# EAGLE schematic OpenBCI_Board (EAGLE 9.7.0)
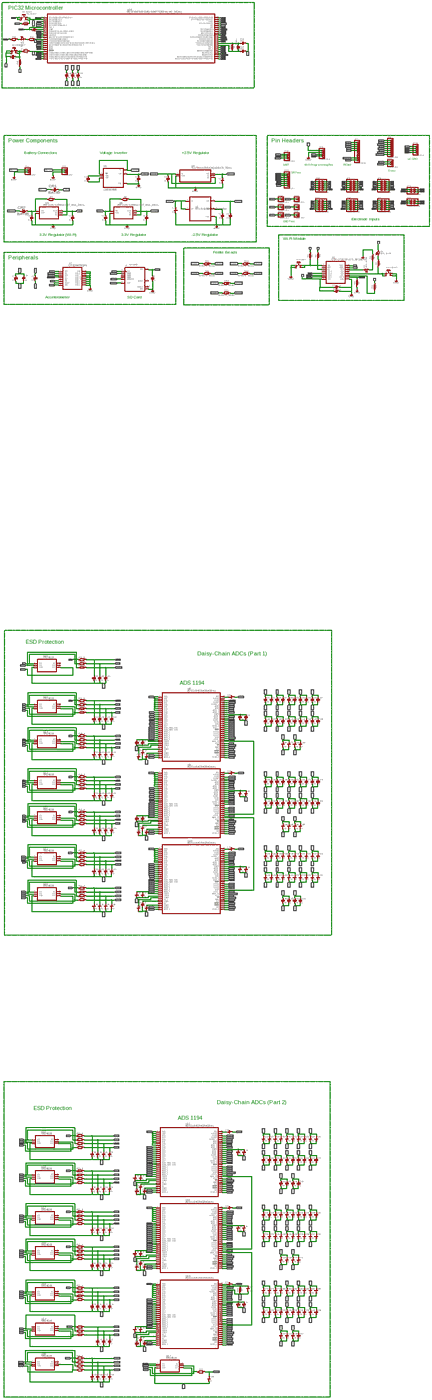
[diagram p0: schematic, sheet 1, overview]
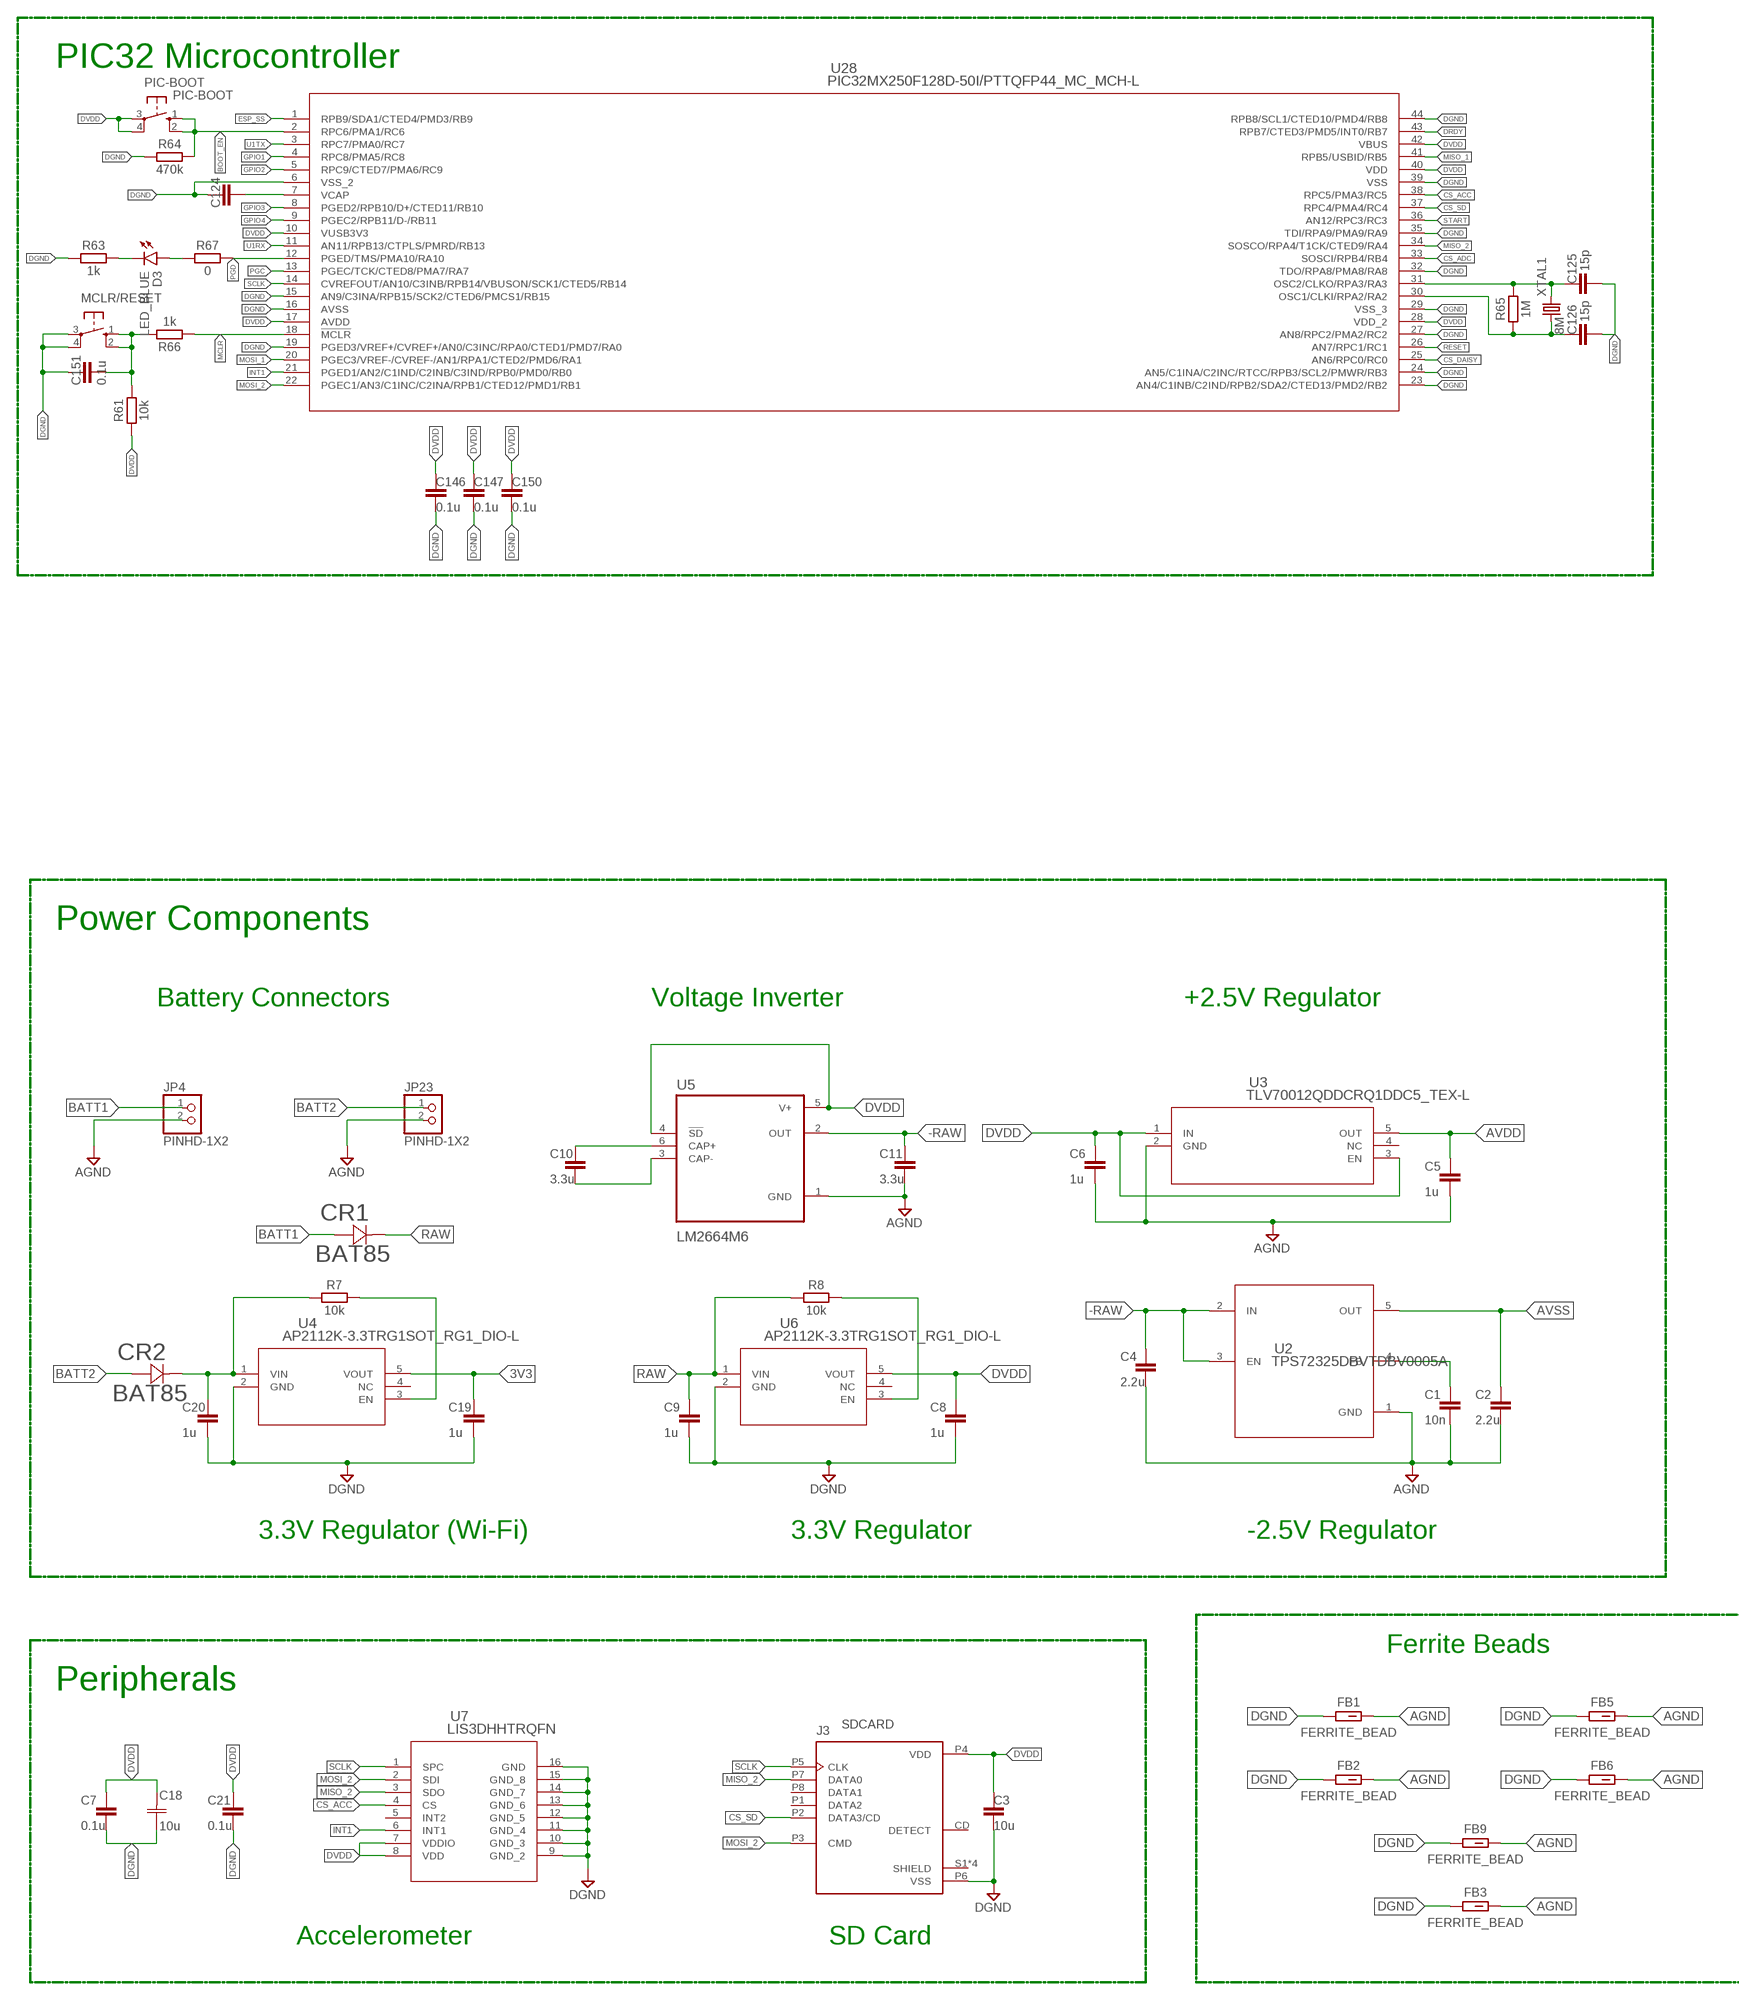
[diagram p1: schematic, sheet 1, part 1 of 4]
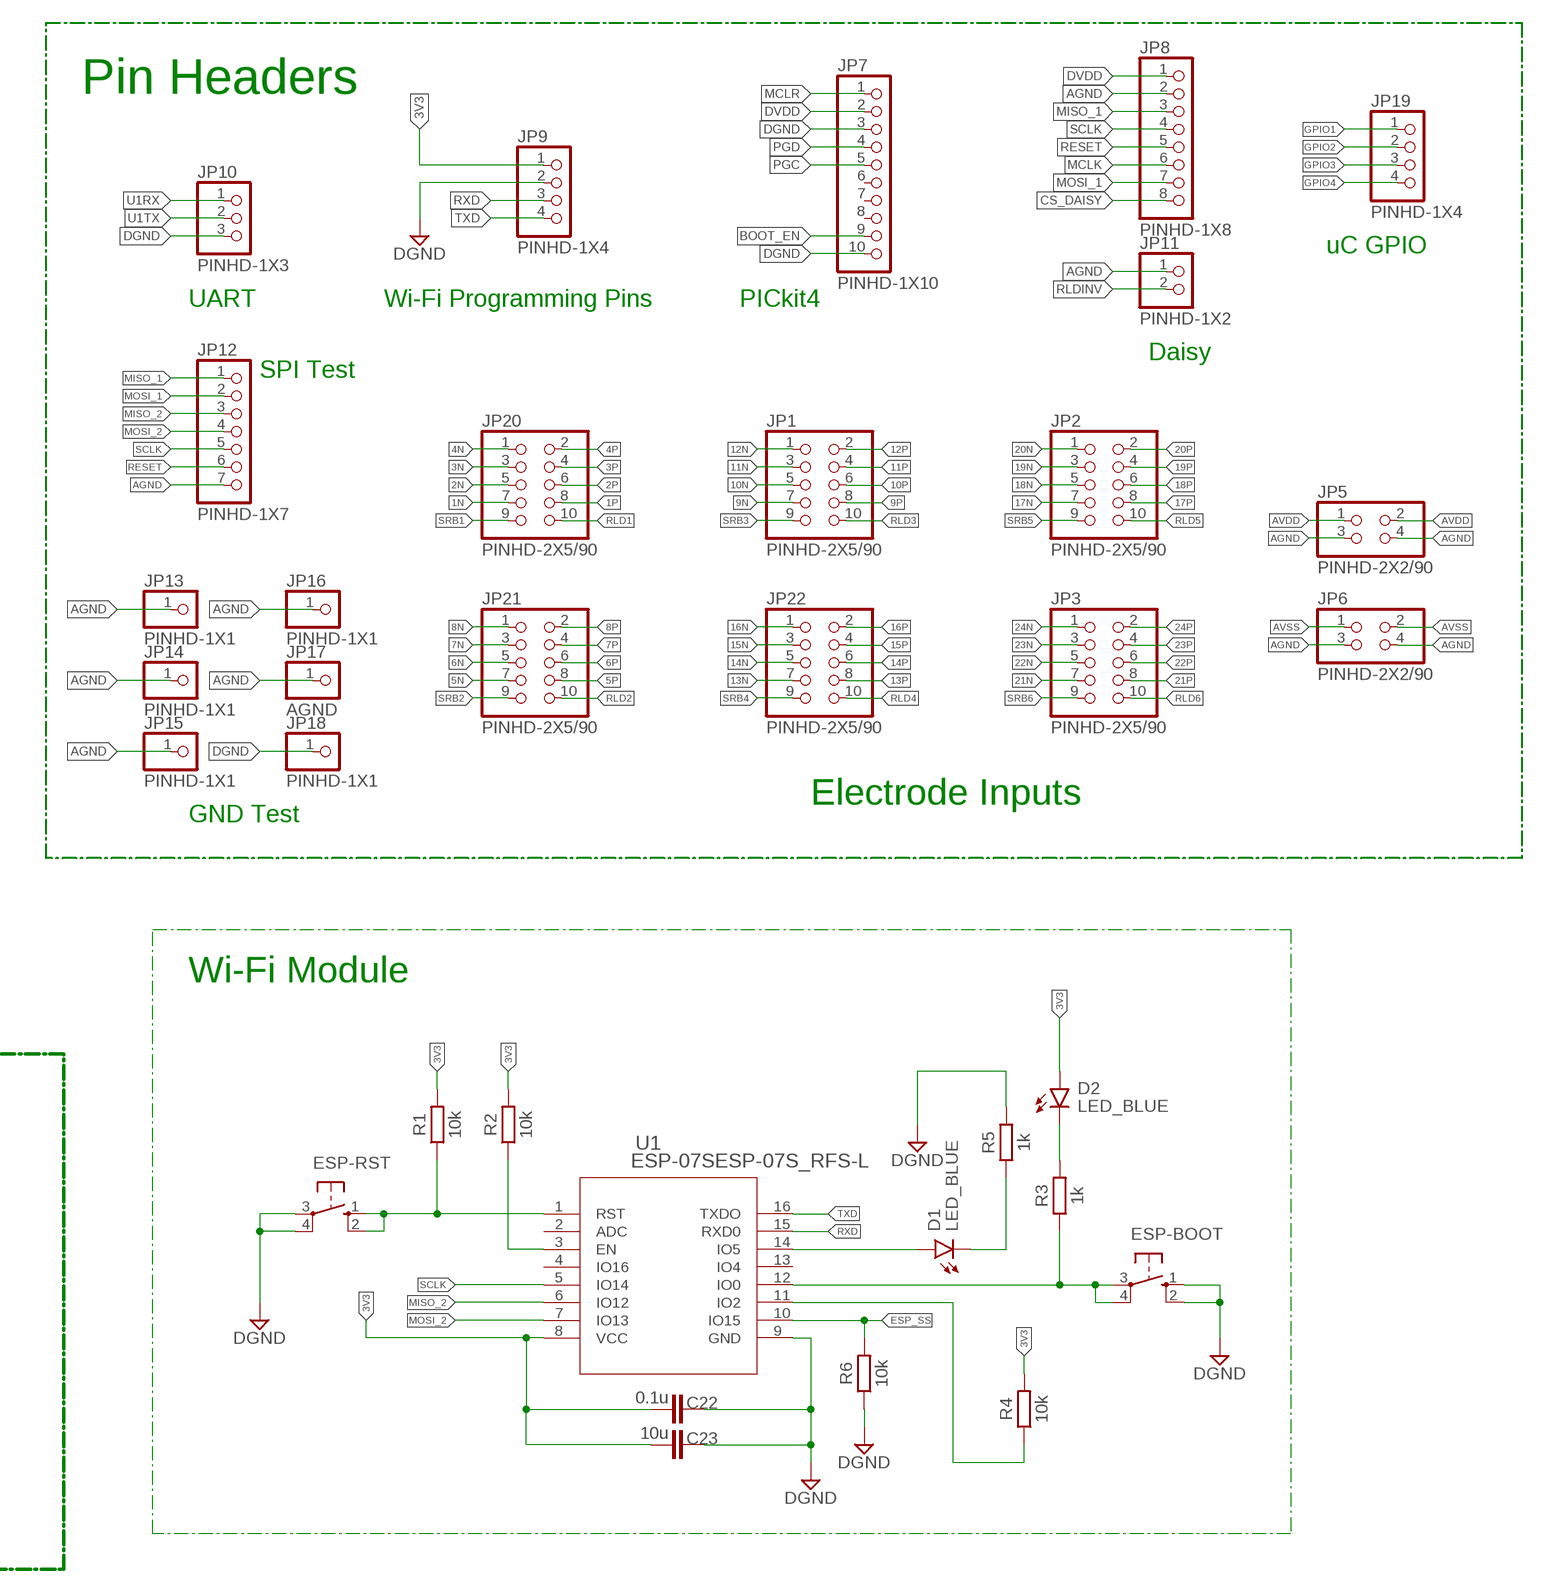
[diagram p2: schematic, sheet 1, part 2 of 4]
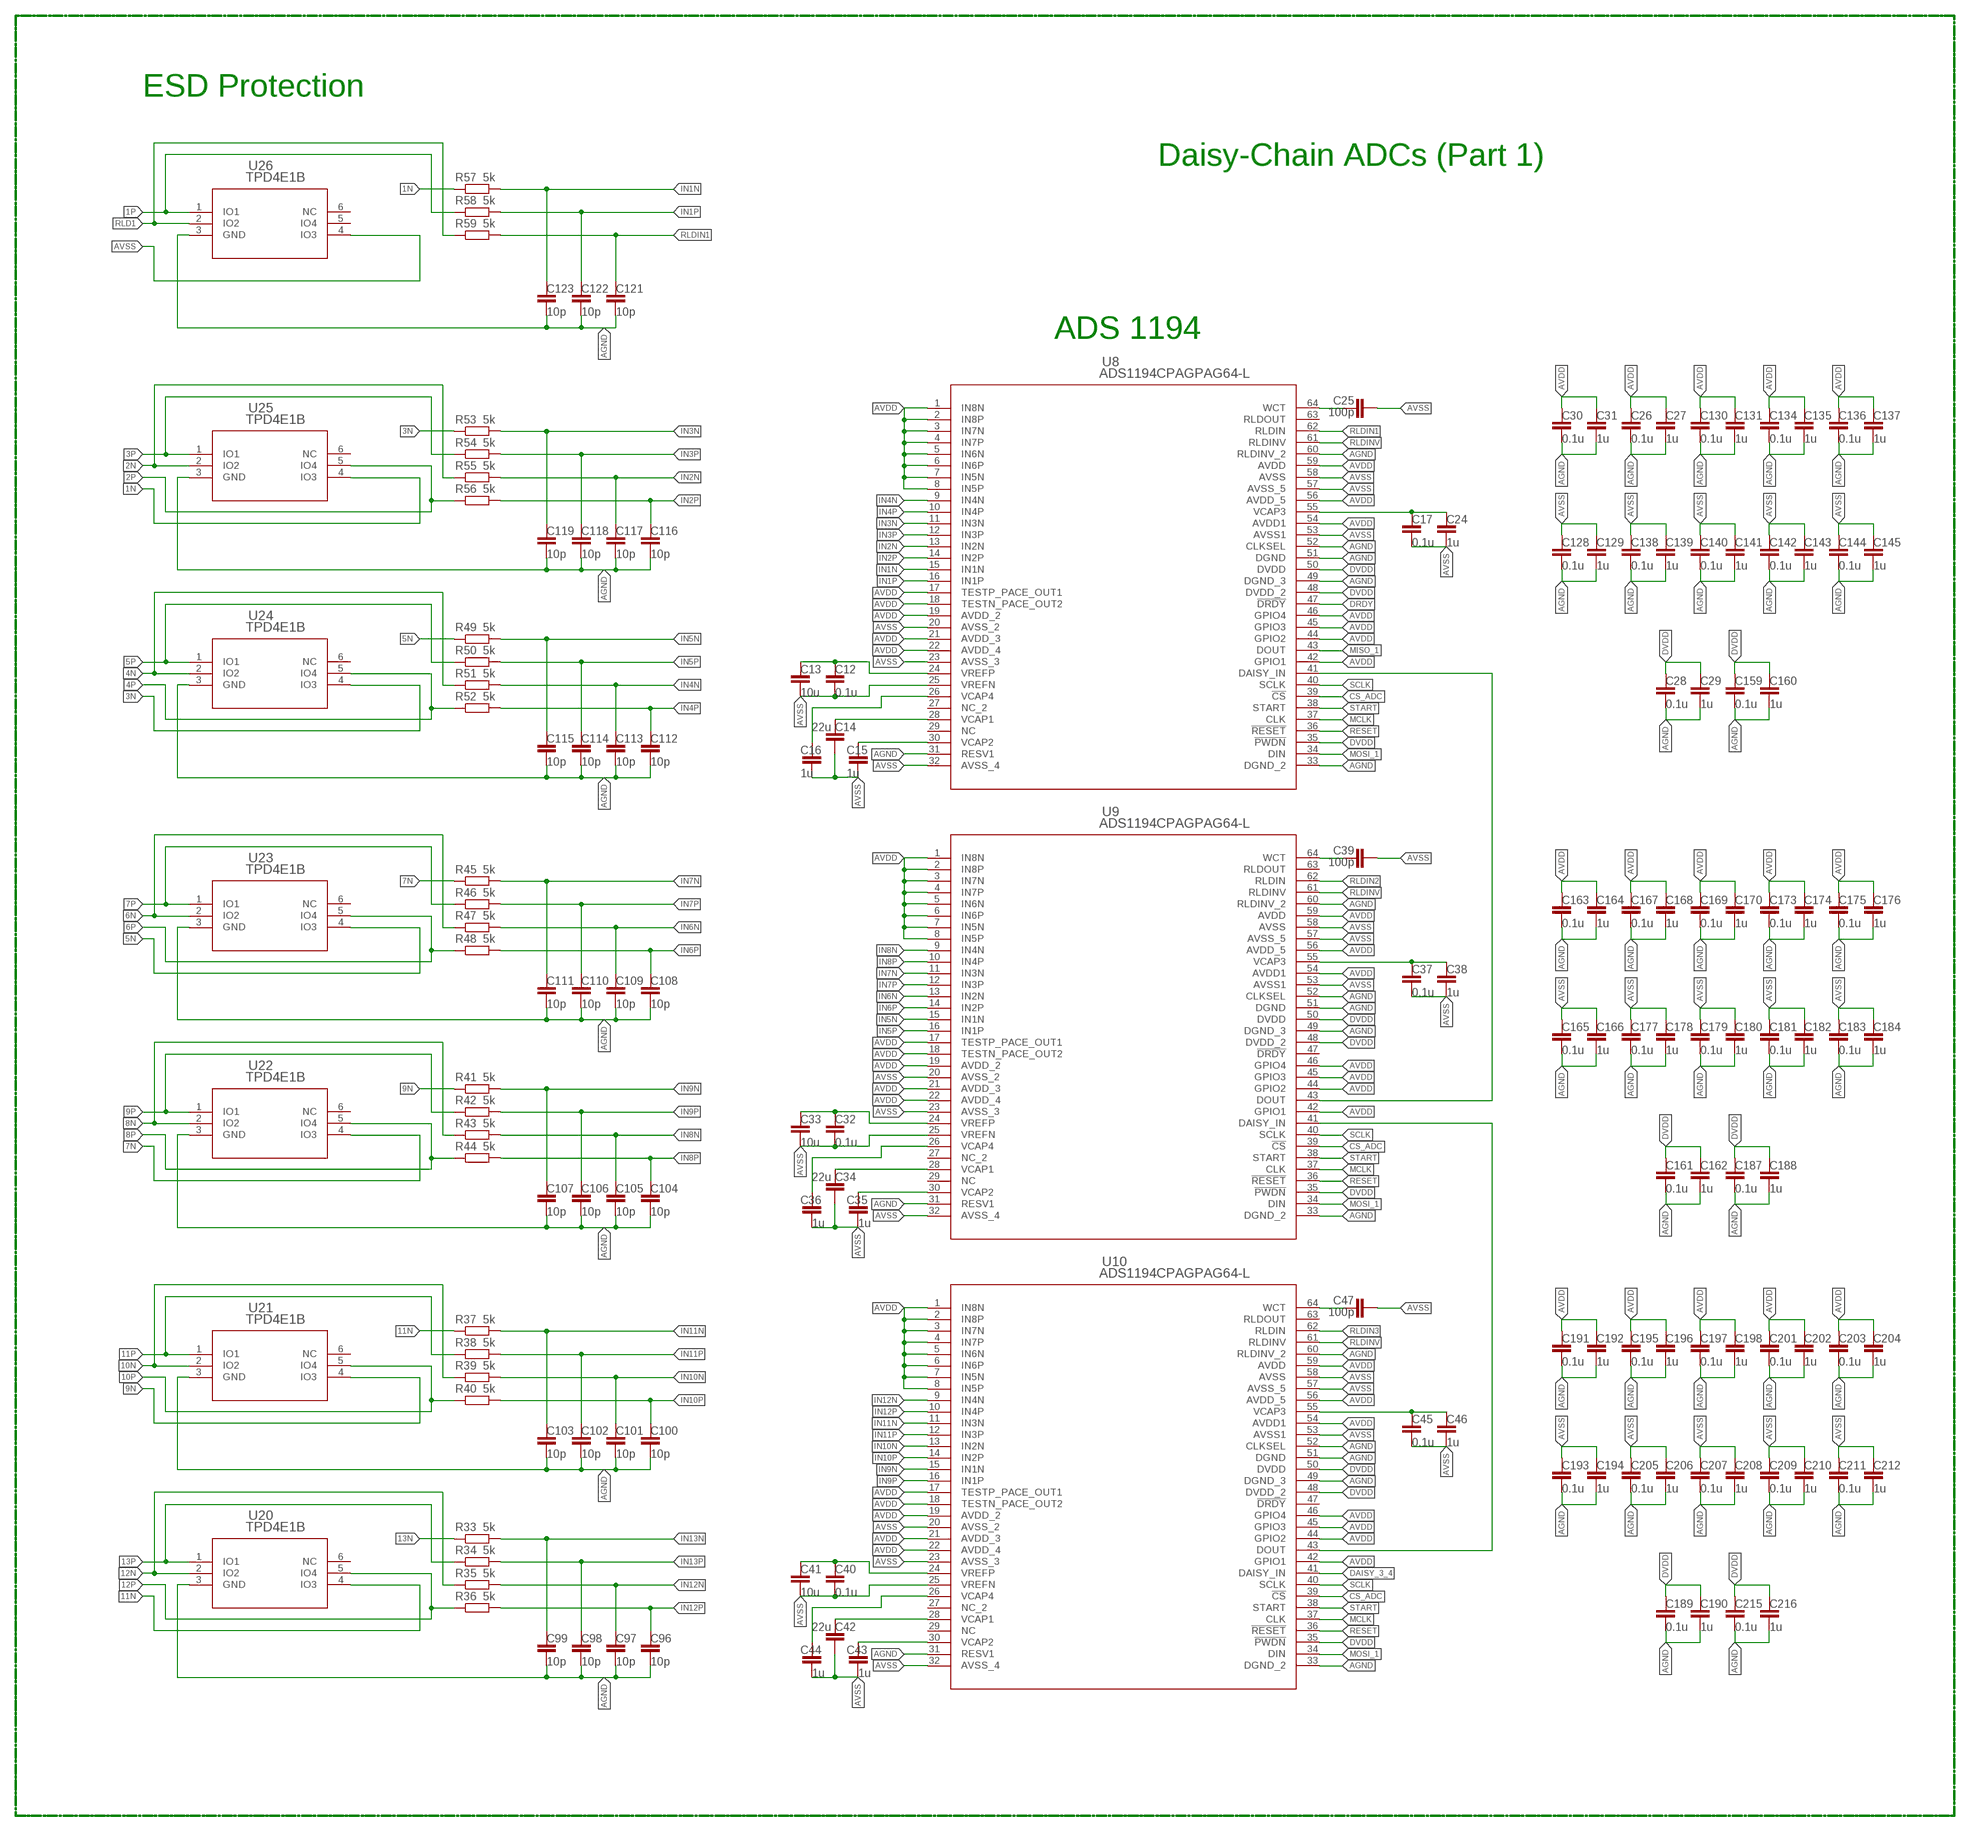
[diagram p3: schematic, sheet 1, part 3 of 4]
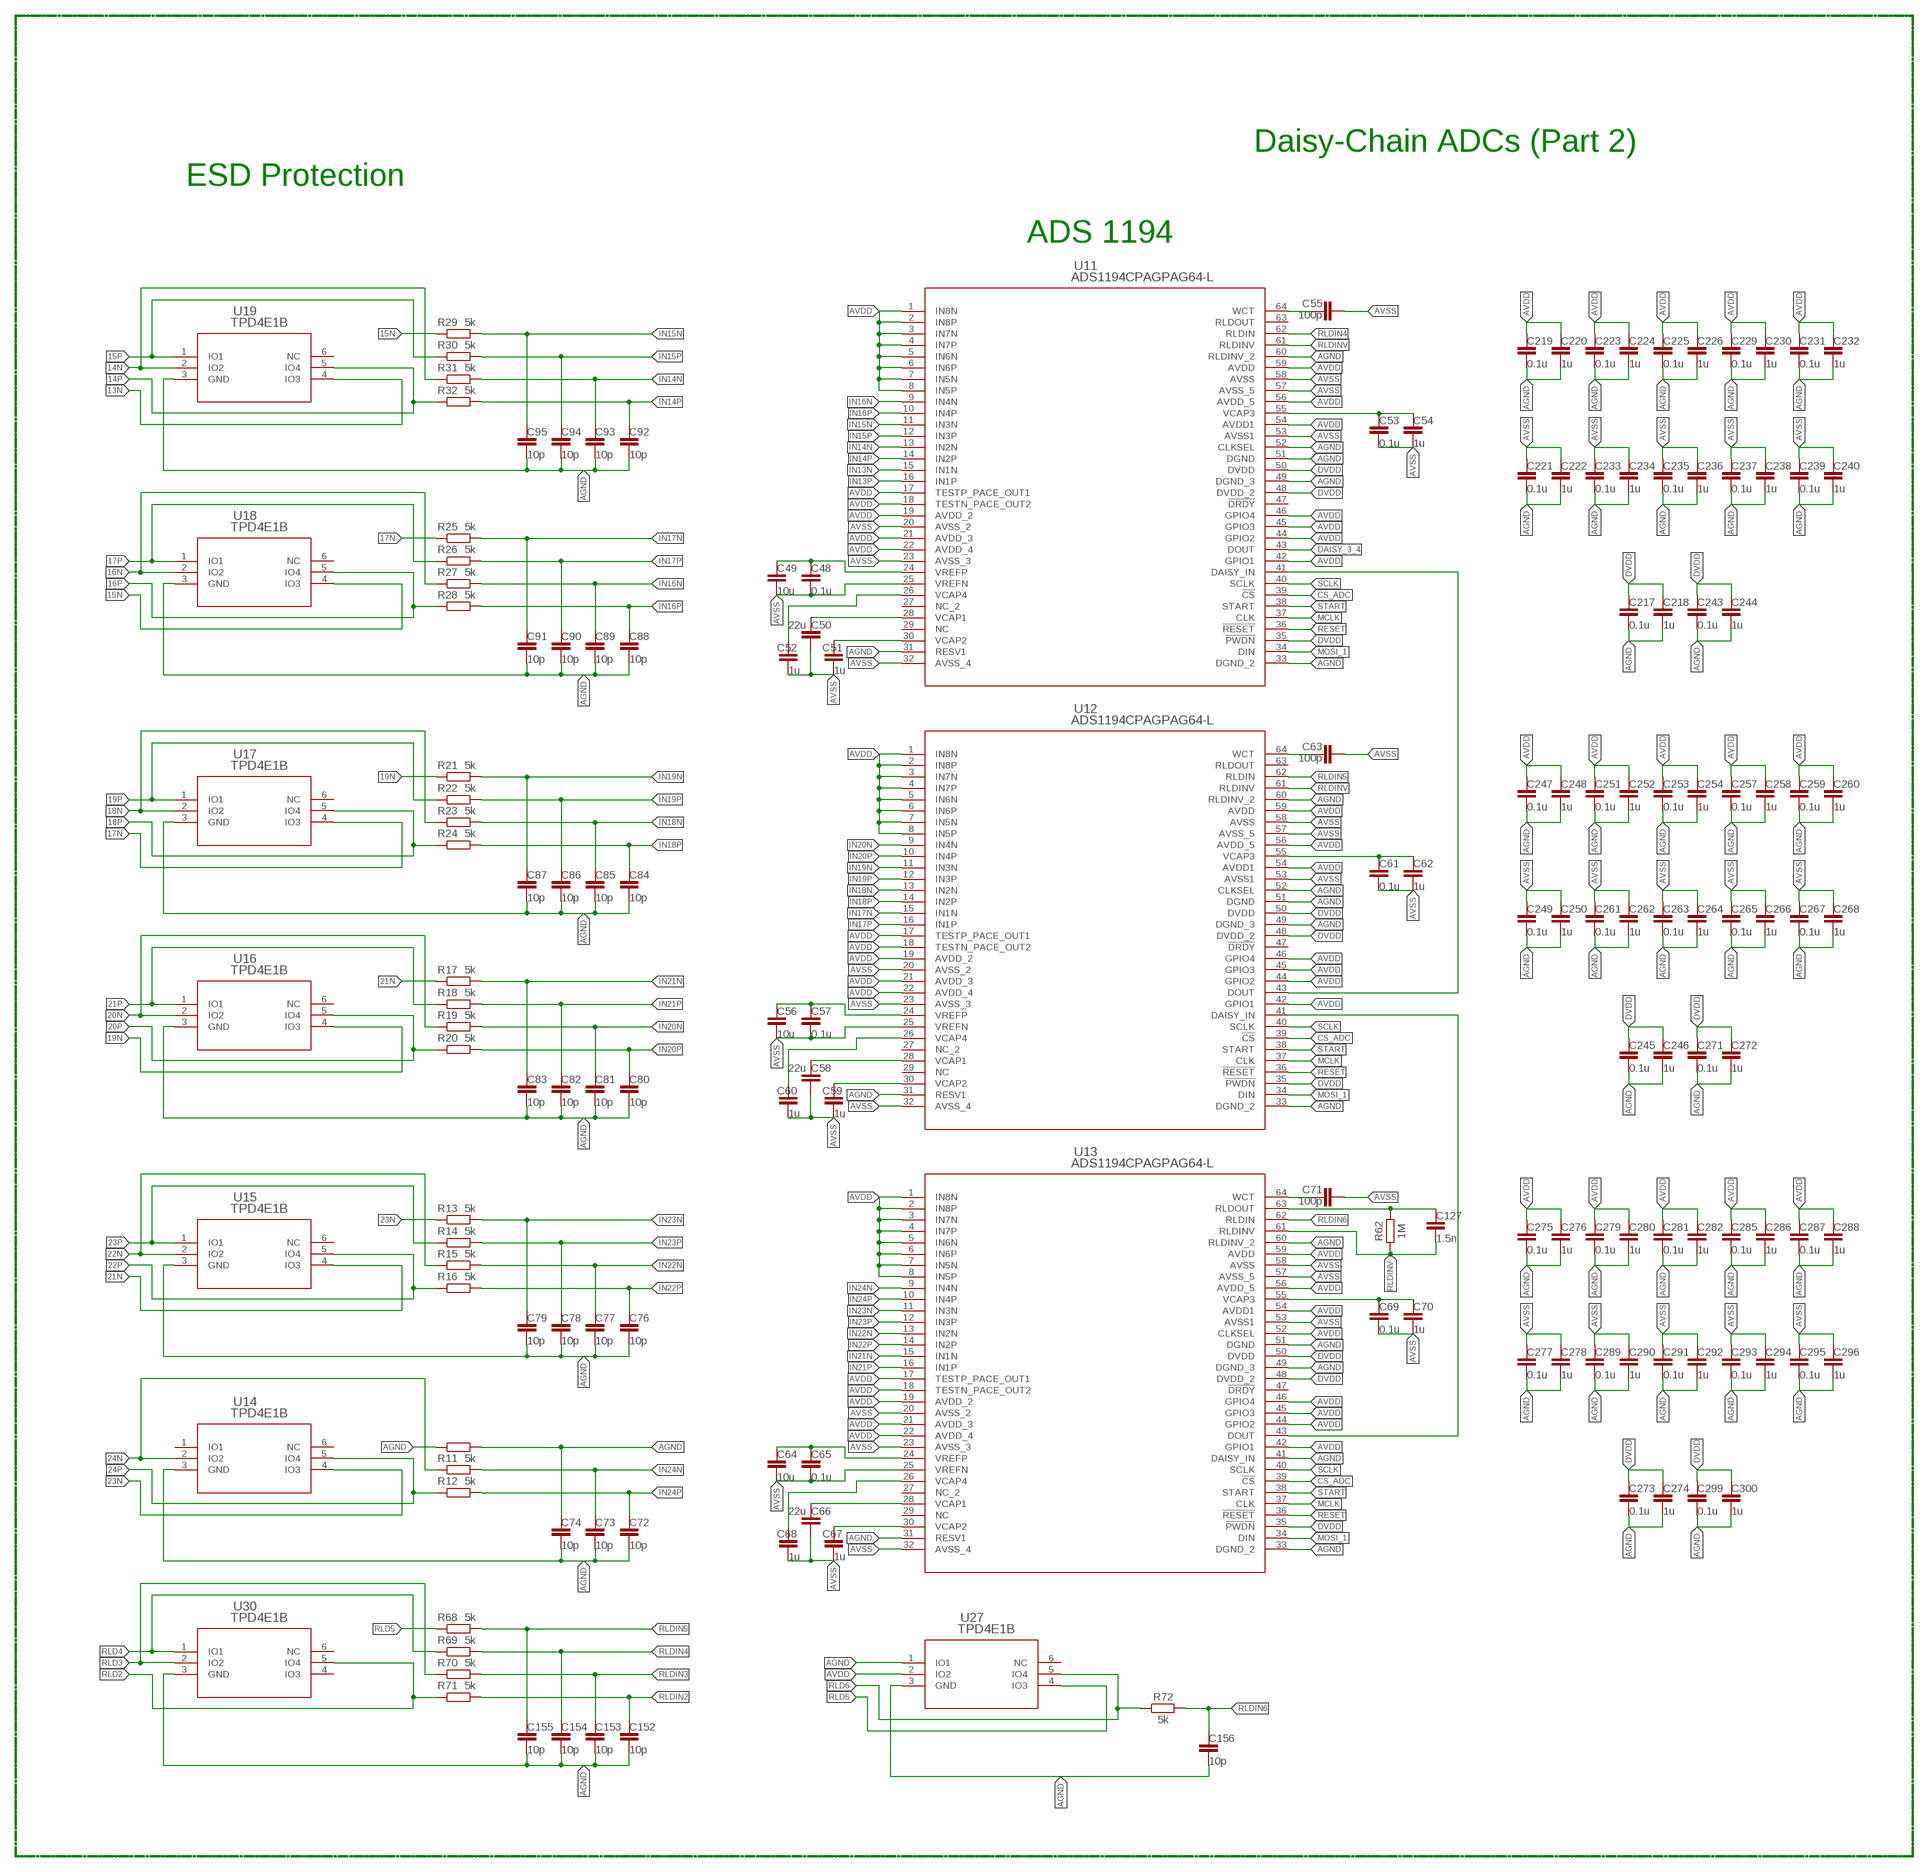
[diagram p4: schematic, sheet 1, part 4 of 4]

## Parts
C1  10n  C_CHIP-0603(1608-METRIC)  [CAPC1608X85]
C2  2.2u  C_CHIP-0603(1608-METRIC)  [CAPC1608X85]
C3  10u  C_CHIP-1206(3216-METRIC)  [CAPC3216X135]
C4  2.2u  C_CHIP-0603(1608-METRIC)  [CAPC1608X85]
C5  1u  C_CHIP-0805(2012-METRIC)  [CAPC2012X110]
C6  1u  C_CHIP-0805(2012-METRIC)  [CAPC2012X110]
C7  0.1u  C_CHIP-0805(2012-METRIC)  [CAPC2012X110]
C8  1u  C_CHIP-0805(2012-METRIC)  [CAPC2012X110]
C9  1u  C_CHIP-0805(2012-METRIC)  [CAPC2012X110]
C10  3.3u  C_CHIP-0603(1608-METRIC)  [CAPC1608X85]
C11  3.3u  C_CHIP-0603(1608-METRIC)  [CAPC1608X85]
C12  0.1u  C_CHIP-0805(2012-METRIC)  [CAPC2012X110]
C13  10u  C_CHIP-1206(3216-METRIC)  [CAPC3216X135]
C14  22u  C_CHIP-1206(3216-METRIC)  [CAPC3216X135]
C15  1u  C_CHIP-0805(2012-METRIC)  [CAPC2012X110]
C16  1u  C_CHIP-0805(2012-METRIC)  [CAPC2012X110]
C17  0.1u  C_CHIP-0805(2012-METRIC)  [CAPC2012X110]
C18  10u  MCVVT035M470EA1LCAP_MCVV_A1_MTC-L  [CAP_MCVV_A1_MTC-L]
C19  1u  C_CHIP-0805(2012-METRIC)  [CAPC2012X110]
C20  1u  C_CHIP-0805(2012-METRIC)  [CAPC2012X110]
C21  0.1u  C_CHIP-0805(2012-METRIC)  [CAPC2012X110]
C22  0.1u  C_CHIP-0805(2012-METRIC)  [CAPC2012X110]
C23  10u  C_CHIP-1206(3216-METRIC)  [CAPC3216X135]
C24  1u  C_CHIP-0805(2012-METRIC)  [CAPC2012X110]
C25  100p  C_CHIP-0603(1608-METRIC)  [CAPC1608X85]
C26  0.1u  C_CHIP-0805(2012-METRIC)  [CAPC2012X110]
C27  1u  C_CHIP-0805(2012-METRIC)  [CAPC2012X110]
C28  0.1u  C_CHIP-0805(2012-METRIC)  [CAPC2012X110]
C29  1u  C_CHIP-0805(2012-METRIC)  [CAPC2012X110]
C30  0.1u  C_CHIP-0805(2012-METRIC)  [CAPC2012X110]
C31  1u  C_CHIP-0805(2012-METRIC)  [CAPC2012X110]
C32  0.1u  C_CHIP-0805(2012-METRIC)  [CAPC2012X110]
C33  10u  C_CHIP-1206(3216-METRIC)  [CAPC3216X135]
C34  22u  C_CHIP-1206(3216-METRIC)  [CAPC3216X135]
C35  1u  C_CHIP-0805(2012-METRIC)  [CAPC2012X110]
C36  1u  C_CHIP-0805(2012-METRIC)  [CAPC2012X110]
C37  0.1u  C_CHIP-0805(2012-METRIC)  [CAPC2012X110]
C38  1u  C_CHIP-0805(2012-METRIC)  [CAPC2012X110]
C39  100p  C_CHIP-0603(1608-METRIC)  [CAPC1608X85]
C40  0.1u  C_CHIP-0805(2012-METRIC)  [CAPC2012X110]
C41  10u  C_CHIP-1206(3216-METRIC)  [CAPC3216X135]
C42  22u  C_CHIP-1206(3216-METRIC)  [CAPC3216X135]
C43  1u  C_CHIP-0805(2012-METRIC)  [CAPC2012X110]
C44  1u  C_CHIP-0805(2012-METRIC)  [CAPC2012X110]
C45  0.1u  C_CHIP-0805(2012-METRIC)  [CAPC2012X110]
C46  1u  C_CHIP-0805(2012-METRIC)  [CAPC2012X110]
C47  100p  C_CHIP-0603(1608-METRIC)  [CAPC1608X85]
C48  0.1u  C_CHIP-0805(2012-METRIC)  [CAPC2012X110]
C49  10u  C_CHIP-1206(3216-METRIC)  [CAPC3216X135]
C50  22u  C_CHIP-1206(3216-METRIC)  [CAPC3216X135]
C51  1u  C_CHIP-0805(2012-METRIC)  [CAPC2012X110]
C52  1u  C_CHIP-0805(2012-METRIC)  [CAPC2012X110]
C53  0.1u  C_CHIP-0805(2012-METRIC)  [CAPC2012X110]
C54  1u  C_CHIP-0805(2012-METRIC)  [CAPC2012X110]
C55  100p  C_CHIP-0603(1608-METRIC)  [CAPC1608X85]
C56  10u  C_CHIP-1206(3216-METRIC)  [CAPC3216X135]
C57  0.1u  C_CHIP-0805(2012-METRIC)  [CAPC2012X110]
C58  22u  C_CHIP-1206(3216-METRIC)  [CAPC3216X135]
C59  1u  C_CHIP-0805(2012-METRIC)  [CAPC2012X110]
C60  1u  C_CHIP-0805(2012-METRIC)  [CAPC2012X110]
C61  0.1u  C_CHIP-0805(2012-METRIC)  [CAPC2012X110]
C62  1u  C_CHIP-0805(2012-METRIC)  [CAPC2012X110]
C63  100p  C_CHIP-0603(1608-METRIC)  [CAPC1608X85]
C64  10u  C_CHIP-1206(3216-METRIC)  [CAPC3216X135]
C65  0.1u  C_CHIP-0805(2012-METRIC)  [CAPC2012X110]
C66  22u  C_CHIP-1206(3216-METRIC)  [CAPC3216X135]
C67  1u  C_CHIP-0805(2012-METRIC)  [CAPC2012X110]
C68  1u  C_CHIP-0805(2012-METRIC)  [CAPC2012X110]
C69  0.1u  C_CHIP-0805(2012-METRIC)  [CAPC2012X110]
C70  1u  C_CHIP-0805(2012-METRIC)  [CAPC2012X110]
C71  100p  C_CHIP-0603(1608-METRIC)  [CAPC1608X85]
C72  10p  C_CHIP-0603(1608-METRIC)  [CAPC1608X85]
C73  10p  C_CHIP-0603(1608-METRIC)  [CAPC1608X85]
C74  10p  C_CHIP-0603(1608-METRIC)  [CAPC1608X85]
C76  10p  C_CHIP-0603(1608-METRIC)  [CAPC1608X85]
C77  10p  C_CHIP-0603(1608-METRIC)  [CAPC1608X85]
C78  10p  C_CHIP-0603(1608-METRIC)  [CAPC1608X85]
C79  10p  C_CHIP-0603(1608-METRIC)  [CAPC1608X85]
C80  10p  C_CHIP-0603(1608-METRIC)  [CAPC1608X85]
C81  10p  C_CHIP-0603(1608-METRIC)  [CAPC1608X85]
C82  10p  C_CHIP-0603(1608-METRIC)  [CAPC1608X85]
C83  10p  C_CHIP-0603(1608-METRIC)  [CAPC1608X85]
C84  10p  C_CHIP-0603(1608-METRIC)  [CAPC1608X85]
C85  10p  C_CHIP-0603(1608-METRIC)  [CAPC1608X85]
C86  10p  C_CHIP-0603(1608-METRIC)  [CAPC1608X85]
C87  10p  C_CHIP-0603(1608-METRIC)  [CAPC1608X85]
C88  10p  C_CHIP-0603(1608-METRIC)  [CAPC1608X85]
C89  10p  C_CHIP-0603(1608-METRIC)  [CAPC1608X85]
C90  10p  C_CHIP-0603(1608-METRIC)  [CAPC1608X85]
C91  10p  C_CHIP-0603(1608-METRIC)  [CAPC1608X85]
C92  10p  C_CHIP-0603(1608-METRIC)  [CAPC1608X85]
C93  10p  C_CHIP-0603(1608-METRIC)  [CAPC1608X85]
C94  10p  C_CHIP-0603(1608-METRIC)  [CAPC1608X85]
C95  10p  C_CHIP-0603(1608-METRIC)  [CAPC1608X85]
C96  10p  C_CHIP-0603(1608-METRIC)  [CAPC1608X85]
C97  10p  C_CHIP-0603(1608-METRIC)  [CAPC1608X85]
C98  10p  C_CHIP-0603(1608-METRIC)  [CAPC1608X85]
C99  10p  C_CHIP-0603(1608-METRIC)  [CAPC1608X85]
C100  10p  C_CHIP-0603(1608-METRIC)  [CAPC1608X85]
C101  10p  C_CHIP-0603(1608-METRIC)  [CAPC1608X85]
C102  10p  C_CHIP-0603(1608-METRIC)  [CAPC1608X85]
C103  10p  C_CHIP-0603(1608-METRIC)  [CAPC1608X85]
C104  10p  C_CHIP-0603(1608-METRIC)  [CAPC1608X85]
C105  10p  C_CHIP-0603(1608-METRIC)  [CAPC1608X85]
C106  10p  C_CHIP-0603(1608-METRIC)  [CAPC1608X85]
C107  10p  C_CHIP-0603(1608-METRIC)  [CAPC1608X85]
C108  10p  C_CHIP-0603(1608-METRIC)  [CAPC1608X85]
C109  10p  C_CHIP-0603(1608-METRIC)  [CAPC1608X85]
C110  10p  C_CHIP-0603(1608-METRIC)  [CAPC1608X85]
C111  10p  C_CHIP-0603(1608-METRIC)  [CAPC1608X85]
C112  10p  C_CHIP-0603(1608-METRIC)  [CAPC1608X85]
C113  10p  C_CHIP-0603(1608-METRIC)  [CAPC1608X85]
C114  10p  C_CHIP-0603(1608-METRIC)  [CAPC1608X85]
C115  10p  C_CHIP-0603(1608-METRIC)  [CAPC1608X85]
C116  10p  C_CHIP-0603(1608-METRIC)  [CAPC1608X85]
C117  10p  C_CHIP-0603(1608-METRIC)  [CAPC1608X85]
C118  10p  C_CHIP-0603(1608-METRIC)  [CAPC1608X85]
C119  10p  C_CHIP-0603(1608-METRIC)  [CAPC1608X85]
C121  10p  C_CHIP-0603(1608-METRIC)  [CAPC1608X85]
C122  10p  C_CHIP-0603(1608-METRIC)  [CAPC1608X85]
C123  10p  C_CHIP-0603(1608-METRIC)  [CAPC1608X85]
C124  10u  C_CHIP-1206(3216-METRIC)  [CAPC3216X135]
C125  15p  C_CHIP-0603(1608-METRIC)  [CAPC1608X85]
C126  15p  C_CHIP-0603(1608-METRIC)  [CAPC1608X85]
C127  1.5n  C_CHIP-0603(1608-METRIC)  [CAPC1608X85]
C128  0.1u  C_CHIP-0805(2012-METRIC)  [CAPC2012X110]
C129  1u  C_CHIP-0805(2012-METRIC)  [CAPC2012X110]
C130  0.1u  C_CHIP-0805(2012-METRIC)  [CAPC2012X110]
C131  1u  C_CHIP-0805(2012-METRIC)  [CAPC2012X110]
C134  0.1u  C_CHIP-0805(2012-METRIC)  [CAPC2012X110]
C135  1u  C_CHIP-0805(2012-METRIC)  [CAPC2012X110]
C136  0.1u  C_CHIP-0805(2012-METRIC)  [CAPC2012X110]
C137  1u  C_CHIP-0805(2012-METRIC)  [CAPC2012X110]
C138  0.1u  C_CHIP-0805(2012-METRIC)  [CAPC2012X110]
C139  1u  C_CHIP-0805(2012-METRIC)  [CAPC2012X110]
C140  0.1u  C_CHIP-0805(2012-METRIC)  [CAPC2012X110]
C141  1u  C_CHIP-0805(2012-METRIC)  [CAPC2012X110]
C142  0.1u  C_CHIP-0805(2012-METRIC)  [CAPC2012X110]
C143  1u  C_CHIP-0805(2012-METRIC)  [CAPC2012X110]
C144  0.1u  C_CHIP-0805(2012-METRIC)  [CAPC2012X110]
C145  1u  C_CHIP-0805(2012-METRIC)  [CAPC2012X110]
C146  0.1u  C_CHIP-0805(2012-METRIC)  [CAPC2012X110]
C147  0.1u  C_CHIP-0805(2012-METRIC)  [CAPC2012X110]
C150  0.1u  C_CHIP-0805(2012-METRIC)  [CAPC2012X110]
C151  0.1u  C_CHIP-0805(2012-METRIC)  [CAPC2012X110]
C152  10p  C_CHIP-0603(1608-METRIC)  [CAPC1608X85]
C153  10p  C_CHIP-0603(1608-METRIC)  [CAPC1608X85]
C154  10p  C_CHIP-0603(1608-METRIC)  [CAPC1608X85]
C155  10p  C_CHIP-0603(1608-METRIC)  [CAPC1608X85]
C156  10p  C_CHIP-0603(1608-METRIC)  [CAPC1608X85]
C159  0.1u  C_CHIP-0805(2012-METRIC)  [CAPC2012X110]
C160  1u  C_CHIP-0805(2012-METRIC)  [CAPC2012X110]
C161  0.1u  C_CHIP-0805(2012-METRIC)  [CAPC2012X110]
C162  1u  C_CHIP-0805(2012-METRIC)  [CAPC2012X110]
C163  0.1u  C_CHIP-0805(2012-METRIC)  [CAPC2012X110]
C164  1u  C_CHIP-0805(2012-METRIC)  [CAPC2012X110]
C165  0.1u  C_CHIP-0805(2012-METRIC)  [CAPC2012X110]
C166  1u  C_CHIP-0805(2012-METRIC)  [CAPC2012X110]
C167  0.1u  C_CHIP-0805(2012-METRIC)  [CAPC2012X110]
C168  1u  C_CHIP-0805(2012-METRIC)  [CAPC2012X110]
C169  0.1u  C_CHIP-0805(2012-METRIC)  [CAPC2012X110]
C170  1u  C_CHIP-0805(2012-METRIC)  [CAPC2012X110]
C173  0.1u  C_CHIP-0805(2012-METRIC)  [CAPC2012X110]
C174  1u  C_CHIP-0805(2012-METRIC)  [CAPC2012X110]
C175  0.1u  C_CHIP-0805(2012-METRIC)  [CAPC2012X110]
C176  1u  C_CHIP-0805(2012-METRIC)  [CAPC2012X110]
C177  0.1u  C_CHIP-0805(2012-METRIC)  [CAPC2012X110]
C178  1u  C_CHIP-0805(2012-METRIC)  [CAPC2012X110]
C179  0.1u  C_CHIP-0805(2012-METRIC)  [CAPC2012X110]
C180  1u  C_CHIP-0805(2012-METRIC)  [CAPC2012X110]
C181  0.1u  C_CHIP-0805(2012-METRIC)  [CAPC2012X110]
C182  1u  C_CHIP-0805(2012-METRIC)  [CAPC2012X110]
C183  0.1u  C_CHIP-0805(2012-METRIC)  [CAPC2012X110]
C184  1u  C_CHIP-0805(2012-METRIC)  [CAPC2012X110]
C187  0.1u  C_CHIP-0805(2012-METRIC)  [CAPC2012X110]
C188  1u  C_CHIP-0805(2012-METRIC)  [CAPC2012X110]
C189  0.1u  C_CHIP-0805(2012-METRIC)  [CAPC2012X110]
C190  1u  C_CHIP-0805(2012-METRIC)  [CAPC2012X110]
C191  0.1u  C_CHIP-0805(2012-METRIC)  [CAPC2012X110]
C192  1u  C_CHIP-0805(2012-METRIC)  [CAPC2012X110]
C193  0.1u  C_CHIP-0805(2012-METRIC)  [CAPC2012X110]
C194  1u  C_CHIP-0805(2012-METRIC)  [CAPC2012X110]
C195  0.1u  C_CHIP-0805(2012-METRIC)  [CAPC2012X110]
C196  1u  C_CHIP-0805(2012-METRIC)  [CAPC2012X110]
C197  0.1u  C_CHIP-0805(2012-METRIC)  [CAPC2012X110]
C198  1u  C_CHIP-0805(2012-METRIC)  [CAPC2012X110]
C201  0.1u  C_CHIP-0805(2012-METRIC)  [CAPC2012X110]
C202  1u  C_CHIP-0805(2012-METRIC)  [CAPC2012X110]
C203  0.1u  C_CHIP-0805(2012-METRIC)  [CAPC2012X110]
C204  1u  C_CHIP-0805(2012-METRIC)  [CAPC2012X110]
C205  0.1u  C_CHIP-0805(2012-METRIC)  [CAPC2012X110]
C206  1u  C_CHIP-0805(2012-METRIC)  [CAPC2012X110]
C207  0.1u  C_CHIP-0805(2012-METRIC)  [CAPC2012X110]
C208  1u  C_CHIP-0805(2012-METRIC)  [CAPC2012X110]
C209  0.1u  C_CHIP-0805(2012-METRIC)  [CAPC2012X110]
C210  1u  C_CHIP-0805(2012-METRIC)  [CAPC2012X110]
C211  0.1u  C_CHIP-0805(2012-METRIC)  [CAPC2012X110]
C212  1u  C_CHIP-0805(2012-METRIC)  [CAPC2012X110]
C215  0.1u  C_CHIP-0805(2012-METRIC)  [CAPC2012X110]
C216  1u  C_CHIP-0805(2012-METRIC)  [CAPC2012X110]
C217  0.1u  C_CHIP-0805(2012-METRIC)  [CAPC2012X110]
C218  1u  C_CHIP-0805(2012-METRIC)  [CAPC2012X110]
C219  0.1u  C_CHIP-0805(2012-METRIC)  [CAPC2012X110]
C220  1u  C_CHIP-0805(2012-METRIC)  [CAPC2012X110]
C221  0.1u  C_CHIP-0805(2012-METRIC)  [CAPC2012X110]
C222  1u  C_CHIP-0805(2012-METRIC)  [CAPC2012X110]
C223  0.1u  C_CHIP-0805(2012-METRIC)  [CAPC2012X110]
C224  1u  C_CHIP-0805(2012-METRIC)  [CAPC2012X110]
C225  0.1u  C_CHIP-0805(2012-METRIC)  [CAPC2012X110]
C226  1u  C_CHIP-0805(2012-METRIC)  [CAPC2012X110]
C229  0.1u  C_CHIP-0805(2012-METRIC)  [CAPC2012X110]
C230  1u  C_CHIP-0805(2012-METRIC)  [CAPC2012X110]
C231  0.1u  C_CHIP-0805(2012-METRIC)  [CAPC2012X110]
C232  1u  C_CHIP-0805(2012-METRIC)  [CAPC2012X110]
C233  0.1u  C_CHIP-0805(2012-METRIC)  [CAPC2012X110]
C234  1u  C_CHIP-0805(2012-METRIC)  [CAPC2012X110]
C235  0.1u  C_CHIP-0805(2012-METRIC)  [CAPC2012X110]
C236  1u  C_CHIP-0805(2012-METRIC)  [CAPC2012X110]
C237  0.1u  C_CHIP-0805(2012-METRIC)  [CAPC2012X110]
C238  1u  C_CHIP-0805(2012-METRIC)  [CAPC2012X110]
C239  0.1u  C_CHIP-0805(2012-METRIC)  [CAPC2012X110]
C240  1u  C_CHIP-0805(2012-METRIC)  [CAPC2012X110]
C243  0.1u  C_CHIP-0805(2012-METRIC)  [CAPC2012X110]
C244  1u  C_CHIP-0805(2012-METRIC)  [CAPC2012X110]
C245  0.1u  C_CHIP-0805(2012-METRIC)  [CAPC2012X110]
C246  1u  C_CHIP-0805(2012-METRIC)  [CAPC2012X110]
C247  0.1u  C_CHIP-0805(2012-METRIC)  [CAPC2012X110]
C248  1u  C_CHIP-0805(2012-METRIC)  [CAPC2012X110]
C249  0.1u  C_CHIP-0805(2012-METRIC)  [CAPC2012X110]
C250  1u  C_CHIP-0805(2012-METRIC)  [CAPC2012X110]
C251  0.1u  C_CHIP-0805(2012-METRIC)  [CAPC2012X110]
C252  1u  C_CHIP-0805(2012-METRIC)  [CAPC2012X110]
C253  0.1u  C_CHIP-0805(2012-METRIC)  [CAPC2012X110]
C254  1u  C_CHIP-0805(2012-METRIC)  [CAPC2012X110]
C257  0.1u  C_CHIP-0805(2012-METRIC)  [CAPC2012X110]
C258  1u  C_CHIP-0805(2012-METRIC)  [CAPC2012X110]
C259  0.1u  C_CHIP-0805(2012-METRIC)  [CAPC2012X110]
C260  1u  C_CHIP-0805(2012-METRIC)  [CAPC2012X110]
C261  0.1u  C_CHIP-0805(2012-METRIC)  [CAPC2012X110]
C262  1u  C_CHIP-0805(2012-METRIC)  [CAPC2012X110]
C263  0.1u  C_CHIP-0805(2012-METRIC)  [CAPC2012X110]
C264  1u  C_CHIP-0805(2012-METRIC)  [CAPC2012X110]
C265  0.1u  C_CHIP-0805(2012-METRIC)  [CAPC2012X110]
C266  1u  C_CHIP-0805(2012-METRIC)  [CAPC2012X110]
C267  0.1u  C_CHIP-0805(2012-METRIC)  [CAPC2012X110]
C268  1u  C_CHIP-0805(2012-METRIC)  [CAPC2012X110]
C271  0.1u  C_CHIP-0805(2012-METRIC)  [CAPC2012X110]
C272  1u  C_CHIP-0805(2012-METRIC)  [CAPC2012X110]
C273  0.1u  C_CHIP-0805(2012-METRIC)  [CAPC2012X110]
C274  1u  C_CHIP-0805(2012-METRIC)  [CAPC2012X110]
C275  0.1u  C_CHIP-0805(2012-METRIC)  [CAPC2012X110]
C276  1u  C_CHIP-0805(2012-METRIC)  [CAPC2012X110]
C277  0.1u  C_CHIP-0805(2012-METRIC)  [CAPC2012X110]
C278  1u  C_CHIP-0805(2012-METRIC)  [CAPC2012X110]
C279  0.1u  C_CHIP-0805(2012-METRIC)  [CAPC2012X110]
C280  1u  C_CHIP-0805(2012-METRIC)  [CAPC2012X110]
C281  0.1u  C_CHIP-0805(2012-METRIC)  [CAPC2012X110]
C282  1u  C_CHIP-0805(2012-METRIC)  [CAPC2012X110]
C285  0.1u  C_CHIP-0805(2012-METRIC)  [CAPC2012X110]
C286  1u  C_CHIP-0805(2012-METRIC)  [CAPC2012X110]
C287  0.1u  C_CHIP-0805(2012-METRIC)  [CAPC2012X110]
C288  1u  C_CHIP-0805(2012-METRIC)  [CAPC2012X110]
C289  0.1u  C_CHIP-0805(2012-METRIC)  [CAPC2012X110]
C290  1u  C_CHIP-0805(2012-METRIC)  [CAPC2012X110]
C291  0.1u  C_CHIP-0805(2012-METRIC)  [CAPC2012X110]
C292  1u  C_CHIP-0805(2012-METRIC)  [CAPC2012X110]
C293  0.1u  C_CHIP-0805(2012-METRIC)  [CAPC2012X110]
C294  1u  C_CHIP-0805(2012-METRIC)  [CAPC2012X110]
C295  0.1u  C_CHIP-0805(2012-METRIC)  [CAPC2012X110]
C296  1u  C_CHIP-0805(2012-METRIC)  [CAPC2012X110]
C299  0.1u  C_CHIP-0805(2012-METRIC)  [CAPC2012X110]
C300  1u  C_CHIP-0805(2012-METRIC)  [CAPC2012X110]
CR1  BAT85  BAT85,113DO-34_NEX  [DO-34_NEX]
CR2  BAT85  BAT85,113DO-34_NEX  [DO-34_NEX]
D1  LED_BLUE  CHIP-FLAT-B_1206  [LEDC3216X75N_FLAT-B]
D2  LED_BLUE  CHIP-FLAT-B_0402  [LEDC1005X25N_FLAT-B]
D3  LED_BLUE  CHIP-FLAT-B_1206  [LEDC3216X75N_FLAT-B]
ESP-BOOT  10-XX  [B3F-10XX]
ESP-RST  10-XX  [B3F-10XX]
FB1  FERRITE_BEAD  FBCHIP-0603(1608-METRIC)  [BEADC1608X95N]
FB2  FERRITE_BEAD  FBCHIP-0603(1608-METRIC)  [BEADC1608X95N]
FB3  FERRITE_BEAD  FBCHIP-0603(1608-METRIC)  [BEADC1608X95N]
FB5  FERRITE_BEAD  FBCHIP-0603(1608-METRIC)  [BEADC1608X95N]
FB6  FERRITE_BEAD  FBCHIP-0603(1608-METRIC)  [BEADC1608X95N]
FB9  FERRITE_BEAD  FBCHIP-0603(1608-METRIC)  [BEADC1608X95N]
J3  SDCARD  MEM2051-00-195-00-A_REVD1MEM2051-00-195-00-A_GCT_MEM2051-00-195-00-A  [GCT_MEM2051-00-195-00-A_REVD1]
JP1  PINHD-2X5/90  [2X05/90]
JP2  PINHD-2X5/90  [2X05/90]
JP3  PINHD-2X5/90  [2X05/90]
JP4  PINHD-1X2  [1X02]
JP5  PINHD-2X2/90  [2X02/90]
JP6  PINHD-2X2/90  [2X02/90]
JP7  PINHD-1X10  [1X10]
JP8  PINHD-1X8  [1X08]
JP9  PINHD-1X4  [1X04]
JP10  PINHD-1X3  [1X03]
JP11  PINHD-1X2  [1X02]
JP12  PINHD-1X7  [1X07]
JP13  PINHD-1X1  [1X01]
JP14  PINHD-1X1  [1X01]
JP15  PINHD-1X1  [1X01]
JP16  PINHD-1X1  [1X01]
JP17  AGND  PINHD-1X1  [1X01]
JP18  PINHD-1X1  [1X01]
JP19  PINHD-1X4  [1X04]
JP20  PINHD-2X5/90  [2X05/90]
JP21  PINHD-2X5/90  [2X05/90]
JP22  PINHD-2X5/90  [2X05/90]
JP23  PINHD-1X2  [1X02]
MCLR/RESET  10-XX  [B3F-10XX]
PIC-BOOT  PIC-BOOT  10-XX  [B3F-10XX]
R1  10k  R_CHIP-0603(1608-METRIC)  [RESC1608X60]
R2  10k  R_CHIP-0603(1608-METRIC)  [RESC1608X60]
R3  1k  R_CHIP-0603(1608-METRIC)  [RESC1608X60]
R4  10k  R_CHIP-0603(1608-METRIC)  [RESC1608X60]
R5  1k  R_CHIP-0603(1608-METRIC)  [RESC1608X60]
R6  10k  R_CHIP-0603(1608-METRIC)  [RESC1608X60]
R7  10k  R_CHIP-0603(1608-METRIC)  [RESC1608X60]
R8  10k  R_CHIP-0603(1608-METRIC)  [RESC1608X60]
R10  5k  R_CHIP-0603(1608-METRIC)  [RESC1608X60]
R11  5k  R_CHIP-0603(1608-METRIC)  [RESC1608X60]
R12  5k  R_CHIP-0603(1608-METRIC)  [RESC1608X60]
R13  5k  R_CHIP-0603(1608-METRIC)  [RESC1608X60]
R14  5k  R_CHIP-0603(1608-METRIC)  [RESC1608X60]
R15  5k  R_CHIP-0603(1608-METRIC)  [RESC1608X60]
R16  5k  R_CHIP-0603(1608-METRIC)  [RESC1608X60]
R17  5k  R_CHIP-0603(1608-METRIC)  [RESC1608X60]
R18  5k  R_CHIP-0603(1608-METRIC)  [RESC1608X60]
R19  5k  R_CHIP-0603(1608-METRIC)  [RESC1608X60]
R20  5k  R_CHIP-0603(1608-METRIC)  [RESC1608X60]
R21  5k  R_CHIP-0603(1608-METRIC)  [RESC1608X60]
R22  5k  R_CHIP-0603(1608-METRIC)  [RESC1608X60]
R23  5k  R_CHIP-0603(1608-METRIC)  [RESC1608X60]
R24  5k  R_CHIP-0603(1608-METRIC)  [RESC1608X60]
R25  5k  R_CHIP-0603(1608-METRIC)  [RESC1608X60]
R26  5k  R_CHIP-0603(1608-METRIC)  [RESC1608X60]
R27  5k  R_CHIP-0603(1608-METRIC)  [RESC1608X60]
R28  5k  R_CHIP-0603(1608-METRIC)  [RESC1608X60]
R29  5k  R_CHIP-0603(1608-METRIC)  [RESC1608X60]
R30  5k  R_CHIP-0603(1608-METRIC)  [RESC1608X60]
R31  5k  R_CHIP-0603(1608-METRIC)  [RESC1608X60]
R32  5k  R_CHIP-0603(1608-METRIC)  [RESC1608X60]
R33  5k  R_CHIP-0603(1608-METRIC)  [RESC1608X60]
R34  5k  R_CHIP-0603(1608-METRIC)  [RESC1608X60]
R35  5k  R_CHIP-0603(1608-METRIC)  [RESC1608X60]
R36  5k  R_CHIP-0603(1608-METRIC)  [RESC1608X60]
R37  5k  R_CHIP-0603(1608-METRIC)  [RESC1608X60]
R38  5k  R_CHIP-0603(1608-METRIC)  [RESC1608X60]
R39  5k  R_CHIP-0603(1608-METRIC)  [RESC1608X60]
R40  5k  R_CHIP-0603(1608-METRIC)  [RESC1608X60]
R41  5k  R_CHIP-0603(1608-METRIC)  [RESC1608X60]
R42  5k  R_CHIP-0603(1608-METRIC)  [RESC1608X60]
R43  5k  R_CHIP-0603(1608-METRIC)  [RESC1608X60]
R44  5k  R_CHIP-0603(1608-METRIC)  [RESC1608X60]
R45  5k  R_CHIP-0603(1608-METRIC)  [RESC1608X60]
R46  5k  R_CHIP-0603(1608-METRIC)  [RESC1608X60]
R47  5k  R_CHIP-0603(1608-METRIC)  [RESC1608X60]
R48  5k  R_CHIP-0603(1608-METRIC)  [RESC1608X60]
R49  5k  R_CHIP-0603(1608-METRIC)  [RESC1608X60]
R50  5k  R_CHIP-0603(1608-METRIC)  [RESC1608X60]
R51  5k  R_CHIP-0603(1608-METRIC)  [RESC1608X60]
R52  5k  R_CHIP-0603(1608-METRIC)  [RESC1608X60]
R53  5k  R_CHIP-0603(1608-METRIC)  [RESC1608X60]
R54  5k  R_CHIP-0603(1608-METRIC)  [RESC1608X60]
R55  5k  R_CHIP-0603(1608-METRIC)  [RESC1608X60]
R56  5k  R_CHIP-0603(1608-METRIC)  [RESC1608X60]
R57  5k  R_CHIP-0603(1608-METRIC)  [RESC1608X60]
R58  5k  R_CHIP-0603(1608-METRIC)  [RESC1608X60]
R59  5k  R_CHIP-0603(1608-METRIC)  [RESC1608X60]
R61  10k  R_CHIP-0603(1608-METRIC)  [RESC1608X60]
R62  1M  R_CHIP-0603(1608-METRIC)  [RESC1608X60]
R63  1k  R_CHIP-0603(1608-METRIC)  [RESC1608X60]
R64  470k  R_CHIP-0603(1608-METRIC)  [RESC1608X60]
R65  1M  R_CHIP-0603(1608-METRIC)  [RESC1608X60]
R66  1k  R_CHIP-0603(1608-METRIC)  [RESC1608X60]
R67  0  R_CHIP-0603(1608-METRIC)  [RESC1608X60]
R68  5k  R_CHIP-0603(1608-METRIC)  [RESC1608X60]
R69  5k  R_CHIP-0603(1608-METRIC)  [RESC1608X60]
R70  5k  R_CHIP-0603(1608-METRIC)  [RESC1608X60]
R71  5k  R_CHIP-0603(1608-METRIC)  [RESC1608X60]
R72  5k  R_CHIP-0603(1608-METRIC)  [RESC1608X60]
U1  ESP-07SESP-07S_RFS-L  [ESP-07S_RFS-L]
U2  TPS72325DBVTDBV0005A  [DBV0005A]
U3  TLV70012QDDCRQ1DDC5_TEX-L  [DDC5_TEX-L]
U4  AP2112K-3.3TRG1SOT_RG1_DIO-L  [SOT_RG1_DIO-L]
U5  LM2664M6  [SOT95P280X145-6N]
U6  AP2112K-3.3TRG1SOT_RG1_DIO-L  [SOT_RG1_DIO-L]
U7  LIS3DHHTRQFN  LIS3DHHTRQFN_ICLX_STM  [QFN_ICLX_STM]
U8  ADS1194CPAGPAG64-L  [PAG64-L]
U9  ADS1194CPAGPAG64-L  [PAG64-L]
U10  ADS1194CPAGPAG64-L  [PAG64-L]
U11  ADS1194CPAGPAG64-L  [PAG64-L]
U12  ADS1194CPAGPAG64-L  [PAG64-L]
U13  ADS1194CPAGPAG64-L  [PAG64-L]
U14  TPD4E1B  TPD4E1B06DCKRDCK6_TEX-L  [DCK6_TEX-L]
U15  TPD4E1B  TPD4E1B06DCKRDCK6_TEX-L  [DCK6_TEX-L]
U16  TPD4E1B  TPD4E1B06DCKRDCK6_TEX-L  [DCK6_TEX-L]
U17  TPD4E1B  TPD4E1B06DCKRDCK6_TEX-L  [DCK6_TEX-L]
U18  TPD4E1B  TPD4E1B06DCKRDCK6_TEX-L  [DCK6_TEX-L]
U19  TPD4E1B  TPD4E1B06DCKRDCK6_TEX-L  [DCK6_TEX-L]
U20  TPD4E1B  TPD4E1B06DCKRDCK6_TEX-L  [DCK6_TEX-L]
U21  TPD4E1B  TPD4E1B06DCKRDCK6_TEX-L  [DCK6_TEX-L]
U22  TPD4E1B  TPD4E1B06DCKRDCK6_TEX-L  [DCK6_TEX-L]
U23  TPD4E1B  TPD4E1B06DCKRDCK6_TEX-L  [DCK6_TEX-L]
U24  TPD4E1B  TPD4E1B06DCKRDCK6_TEX-L  [DCK6_TEX-L]
U25  TPD4E1B  TPD4E1B06DCKRDCK6_TEX-L  [DCK6_TEX-L]
U26  TPD4E1B  TPD4E1B06DCKRDCK6_TEX-L  [DCK6_TEX-L]
U27  TPD4E1B  TPD4E1B06DCKRDCK6_TEX-L  [DCK6_TEX-L]
U28  PIC32MX250F128D-50I/PTTQFP44_MC_MCH-L  [TQFP44_MC_MCH-L]
U30  TPD4E1B  TPD4E1B06DCKRDCK6_TEX-L  [DCK6_TEX-L]
XTAL1  8M  CRYSTAL_HC49-11.5L  [XTALRR488W45L1150T500H350B]

## Nets
1N: JP20.7 R57.1 U25.4(IO3)
1P: JP20.8 R58.1 U26.1(IO1)
2N: JP20.5 R55.1 U25.2(IO2)
2P: JP20.6 R56.1 U25.5(IO4)
3N: JP20.3 R53.1 U24.4(IO3)
3P: JP20.4 R54.1 U25.1(IO1)
3V3: C19.1 C22.1 C23.1 D2.A JP9.1 R1.2 R2.2 R4.2 U1.8(VCC) U4.5(VOUT)
4N: JP20.1 R51.1 U24.2(IO2)
4P: JP20.2 R52.1 U24.5(IO4)
5N: JP21.7 R49.1 U23.4(IO3)
5P: JP21.8 R50.1 U24.1(IO1)
6N: JP21.5 R47.1 U23.2(IO2)
6P: JP21.6 R48.1 U23.5(IO4)
7N: JP21.3 R45.1 U22.4(IO3)
7P: JP21.4 R46.1 U23.1(IO1)
8N: JP21.1 R43.1 U22.2(IO2)
8P: JP21.2 R44.1 U22.5(IO4)
9N: JP1.7 R41.1 U21.4(IO3)
9P: JP1.8 R42.1 U22.1(IO1)
10N: JP1.5 R39.1 U21.2(IO2)
10P: JP1.6 R40.1 U21.5(IO4)
11N: JP1.3 R37.1 U20.4(IO3)
11P: JP1.4 R38.1 U21.1(IO1)
12N: JP1.1 R35.1 U20.2(IO2)
12P: JP1.2 R36.1 U20.5(IO4)
13N: JP22.7 R33.1 U19.4(IO3)
13P: JP22.8 R34.1 U20.1(IO1)
14N: JP22.5 R31.1 U19.2(IO2)
14P: JP22.6 R32.1 U19.5(IO4)
15N: JP22.3 R29.1 U18.4(IO3)
15P: JP22.4 R30.1 U19.1(IO1)
16N: JP22.1 R27.1 U18.2(IO2)
16P: JP22.2 R28.1 U18.5(IO4)
17N: JP2.7 R25.1 U17.4(IO3)
17P: JP2.8 R26.1 U18.1(IO1)
18N: JP2.5 R23.1 U17.2(IO2)
18P: JP2.6 R24.1 U17.5(IO4)
19N: JP2.3 R21.1 U16.4(IO3)
19P: JP2.4 R22.1 U17.1(IO1)
20N: JP2.1 R19.1 U16.2(IO2)
20P: JP2.2 R20.1 U16.5(IO4)
21N: JP3.7 R17.1 U15.4(IO3)
21P: JP3.8 R18.1 U16.1(IO1)
22N: JP3.5 R15.1 U15.2(IO2)
22P: JP3.6 R16.1 U15.5(IO4)
23N: JP3.3 R13.1 U14.4(IO3)
23P: JP3.4 R14.1 U15.1(IO1)
24N: JP3.1 R11.1 U14.2(IO2)
24P: JP3.2 R12.1 U14.5(IO4)
-RAW: C4.1 C11.1 U2.2(IN) U2.3(EN) U5.2(OUT)
AGND: C1.2 C2.2 C4.2 C5.2 C6.2 C11.2 C26.2 C27.2 C28.2 C29.2 C30.2 C31.2 C72.2 C73.2 C74.1 C74.2 C76.2 C77.2 C78.2 C79.2 C80.2 C81.2 C82.2 C83.2 C84.2 C85.2 C86.2 C87.2 C88.2 C89.2 C90.2 C91.2 C92.2 C93.2 C94.2 C95.2 C96.2 C97.2 C98.2 C99.2 C100.2 C101.2 C102.2 C103.2 C104.2 C105.2 C106.2 C107.2 C108.2 C109.2 C110.2 C111.2 C112.2 C113.2 C114.2 C115.2 C116.2 C117.2 C118.2 C119.2 C121.2 C122.2 C123.2 C128.2 C129.2 C130.2 C131.2 C134.2 C135.2 C136.2 C137.2 C138.2 C139.2 C140.2 C141.2 C142.2 C143.2 C144.2 C145.2 C152.2 C153.2 C154.2 C155.2 C156.2 C159.2 C160.2 C161.2 C162.2 C163.2 C164.2 C165.2 C166.2 C167.2 C168.2 C169.2 C170.2 C173.2 C174.2 C175.2 C176.2 C177.2 C178.2 C179.2 C180.2 C181.2 C182.2 C183.2 C184.2 C187.2 C188.2 C189.2 C190.2 C191.2 C192.2 C193.2 C194.2 C195.2 C196.2 C197.2 C198.2 C201.2 C202.2 C203.2 C204.2 C205.2 C206.2 C207.2 C208.2 C209.2 C210.2 C211.2 C212.2 C215.2 C216.2 C217.2 C218.2 C219.2 C220.2 C221.2 C222.2 C223.2 C224.2 C225.2 C226.2 C229.2 C230.2 C231.2 C232.2 C233.2 C234.2 C235.2 C236.2 C237.2 C238.2 C239.2 C240.2 C243.2 C244.2 C245.2 C246.2 C247.2 C248.2 C249.2 C250.2 C251.2 C252.2 C253.2 C254.2 C257.2 C258.2 C259.2 C260.2 C261.2 C262.2 C263.2 C264.2 C265.2 C266.2 C267.2 C268.2 C271.2 C272.2 C273.2 C274.2 C275.2 C276.2 C277.2 C278.2 C279.2 C280.2 C281.2 C282.2 C285.2 C286.2 C287.2 C288.2 C289.2 C290.2 C291.2 C292.2 C293.2 C294.2 C295.2 C296.2 C299.2 C300.2 FB1.2 FB2.2 FB3.2 FB5.2 FB6.2 FB9.2 JP4.2 JP5.3 JP5.4 JP6.3 JP6.4 JP8.2 JP11.1 JP12.7 JP13.1 JP14.1 JP15.1 JP16.1 JP17.1 JP23.2 R10.1 R10.2 U2.1(GND) U3.2(GND) U5.1(GND) U8.31(RESV1) U8.33(DGND_2) U8.49(DGND_3) U8.51(DGND) U8.52(CLKSEL) U8.60(RLDINV_2) U9.31(RESV1) U9.33(DGND_2) U9.49(DGND_3) U9.51(DGND) U9.52(CLKSEL) U9.60(RLDINV_2) U10.31(RESV1) U10.33(DGND_2) U10.49(DGND_3) U10.51(DGND) U10.52(CLKSEL) U10.60(RLDINV_2) U11.31(RESV1) U11.33(DGND_2) U11.49(DGND_3) U11.51(DGND) U11.52(CLKSEL) U11.60(RLDINV_2) U12.31(RESV1) U12.33(DGND_2) U12.49(DGND_3) U12.51(DGND) U12.52(CLKSEL) U12.60(RLDINV_2) U13.31(RESV1) U13.33(DGND_2) U13.41(DAISY_IN) U13.49(DGND_3) U13.51(DGND) U13.60(RLDINV_2) U14.3(GND) U15.3(GND) U16.3(GND) U17.3(GND) U18.3(GND) U19.3(GND) U20.3(GND) U21.3(GND) U22.3(GND) U23.3(GND) U24.3(GND) U25.3(GND) U26.3(GND) U27.1(IO1) U27.3(GND) U30.3(GND)
AVDD: C5.1 C26.1 C27.1 C30.1 C31.1 C130.1 C131.1 C134.1 C135.1 C136.1 C137.1 C163.1 C164.1 C167.1 C168.1 C169.1 C170.1 C173.1 C174.1 C175.1 C176.1 C191.1 C192.1 C195.1 C196.1 C197.1 C198.1 C201.1 C202.1 C203.1 C204.1 C219.1 C220.1 C223.1 C224.1 C225.1 C226.1 C229.1 C230.1 C231.1 C232.1 C247.1 C248.1 C251.1 C252.1 C253.1 C254.1 C257.1 C258.1 C259.1 C260.1 C275.1 C276.1 C279.1 C280.1 C281.1 C282.1 C285.1 C286.1 C287.1 C288.1 JP5.1 JP5.2 U3.5(OUT) U8.1(IN8N) U8.2(IN8P) U8.3(IN7N) U8.4(IN7P) U8.5(IN6N) U8.6(IN6P) U8.7(IN5N) U8.8(IN5P) U8.17(TESTP_PACE_OUT1) U8.18(TESTN_PACE_OUT2) U8.19(AVDD_2) U8.21(AVDD_3) U8.22(AVDD_4) U8.42(GPIO1) U8.44(GPIO2) U8.45(GPIO3) U8.46(GPIO4) U8.54(AVDD1) U8.56(AVDD_5) U8.59(AVDD) U9.1(IN8N) U9.2(IN8P) U9.3(IN7N) U9.4(IN7P) U9.5(IN6N) U9.6(IN6P) U9.7(IN5N) U9.8(IN5P) U9.17(TESTP_PACE_OUT1) U9.18(TESTN_PACE_OUT2) U9.19(AVDD_2) U9.21(AVDD_3) U9.22(AVDD_4) U9.42(GPIO1) U9.44(GPIO2) U9.45(GPIO3) U9.46(GPIO4) U9.54(AVDD1) U9.56(AVDD_5) U9.59(AVDD) U10.1(IN8N) U10.2(IN8P) U10.3(IN7N) U10.4(IN7P) U10.5(IN6N) U10.6(IN6P) U10.7(IN5N) U10.8(IN5P) U10.17(TESTP_PACE_OUT1) U10.18(TESTN_PACE_OUT2) U10.19(AVDD_2) U10.21(AVDD_3) U10.22(AVDD_4) U10.42(GPIO1) U10.44(GPIO2) U10.45(GPIO3) U10.46(GPIO4) U10.54(AVDD1) U10.56(AVDD_5) U10.59(AVDD) U11.1(IN8N) U11.2(IN8P) U11.3(IN7N) U11.4(IN7P) U11.5(IN6N) U11.6(IN6P) U11.7(IN5N) U11.8(IN5P) U11.17(TESTP_PACE_OUT1) U11.18(TESTN_PACE_OUT2) U11.19(AVDD_2) U11.21(AVDD_3) U11.22(AVDD_4) U11.42(GPIO1) U11.44(GPIO2) U11.45(GPIO3) U11.46(GPIO4) U11.54(AVDD1) U11.56(AVDD_5) U11.59(AVDD) U12.1(IN8N) U12.2(IN8P) U12.3(IN7N) U12.4(IN7P) U12.5(IN6N) U12.6(IN6P) U12.7(IN5N) U12.8(IN5P) U12.17(TESTP_PACE_OUT1) U12.18(TESTN_PACE_OUT2) U12.19(AVDD_2) U12.21(AVDD_3) U12.22(AVDD_4) U12.42(GPIO1) U12.44(GPIO2) U12.45(GPIO3) U12.46(GPIO4) U12.54(AVDD1) U12.56(AVDD_5) U12.59(AVDD) U13.1(IN8N) U13.2(IN8P) U13.3(IN7N) U13.4(IN7P) U13.5(IN6N) U13.6(IN6P) U13.7(IN5N) U13.8(IN5P) U13.17(TESTP_PACE_OUT1) U13.18(TESTN_PACE_OUT2) U13.19(AVDD_2) U13.21(AVDD_3) U13.22(AVDD_4) U13.42(GPIO1) U13.44(GPIO2) U13.45(GPIO3) U13.46(GPIO4) U13.52(CLKSEL) U13.54(AVDD1) U13.56(AVDD_5) U13.59(AVDD) U27.2(IO2)
AVSS: C2.1 C12.2 C13.2 C14.2 C15.2 C16.2 C17.2 C24.2 C25.2 C32.2 C33.2 C34.2 C35.2 C36.2 C37.2 C38.2 C39.2 C40.2 C41.2 C42.2 C43.2 C44.2 C45.2 C46.2 C47.2 C48.2 C49.2 C50.2 C51.2 C52.2 C53.2 C54.2 C55.2 C56.2 C57.2 C58.2 C59.2 C60.2 C61.2 C62.2 C63.2 C64.2 C65.2 C66.2 C67.2 C68.2 C69.2 C70.2 C71.2 C128.1 C129.1 C138.1 C139.1 C140.1 C141.1 C142.1 C143.1 C144.1 C145.1 C165.1 C166.1 C177.1 C178.1 C179.1 C180.1 C181.1 C182.1 C183.1 C184.1 C193.1 C194.1 C205.1 C206.1 C207.1 C208.1 C209.1 C210.1 C211.1 C212.1 C221.1 C222.1 C233.1 C234.1 C235.1 C236.1 C237.1 C238.1 C239.1 C240.1 C249.1 C250.1 C261.1 C262.1 C263.1 C264.1 C265.1 C266.1 C267.1 C268.1 C277.1 C278.1 C289.1 C290.1 C291.1 C292.1 C293.1 C294.1 C295.1 C296.1 JP6.1 JP6.2 U2.5(OUT) U8.20(AVSS_2) U8.23(AVSS_3) U8.25(VREFN) U8.32(AVSS_4) U8.53(AVSS1) U8.57(AVSS_5) U8.58(AVSS) U9.20(AVSS_2) U9.23(AVSS_3) U9.25(VREFN) U9.32(AVSS_4) U9.53(AVSS1) U9.57(AVSS_5) U9.58(AVSS) U10.20(AVSS_2) U10.23(AVSS_3) U10.25(VREFN) U10.32(AVSS_4) U10.53(AVSS1) U10.57(AVSS_5) U10.58(AVSS) U11.20(AVSS_2) U11.23(AVSS_3) U11.25(VREFN) U11.32(AVSS_4) U11.53(AVSS1) U11.57(AVSS_5) U11.58(AVSS) U12.20(AVSS_2) U12.23(AVSS_3) U12.25(VREFN) U12.32(AVSS_4) U12.53(AVSS1) U12.57(AVSS_5) U12.58(AVSS) U13.20(AVSS_2) U13.23(AVSS_3) U13.25(VREFN) U13.32(AVSS_4) U13.53(AVSS1) U13.57(AVSS_5) U13.58(AVSS) U26.4(IO3)
BATT1: CR1.2 JP4.1
BATT2: CR2.2 JP23.1
BOOT_EN: JP7.9 PIC-BOOT.1(S) PIC-BOOT.2(S1) R64.2 U28.2(RPC6/PMA1/RC6)
CS_ACC: U7.4(CS) U28.38(RPC5/PMA3/RC5)
CS_ADC: U8.39(!CS) U9.39(!CS) U10.39(!CS) U11.39(!CS) U12.39(!CS) U13.39(!CS) U28.33(SOSCI/RPB4/RB4)
CS_DAISY: JP8.8 U28.25(AN6/RPC0/RC0)
CS_SD: J3.P2(DATA3/CD) U28.37(RPC4/PMA4/RC4)
DAISY_3_4: U10.41(DAISY_IN) U11.43(DOUT)
DGND: C3.2 C7.2 C8.2 C9.2 C18.1 C19.2 C20.2 C21.2 C22.2 C23.2 C124.1 C125.2 C126.2 C146.2 C147.2 C150.2 C151.1 ESP-BOOT.1(S) ESP-BOOT.2(S1) ESP-RST.3(P) ESP-RST.4(P1) FB1.1 FB2.1 FB3.1 FB5.1 FB6.1 FB9.1 J3.P6(VSS) JP7.3 JP7.10 JP9.2 JP10.3 JP18.1 MCLR/RESET.3(P) MCLR/RESET.4(P1) R5.2 R6.1 R63.1 R64.1 U1.9(GND) U4.2(GND) U6.2(GND) U7.9(GND_2) U7.10(GND_3) U7.11(GND_4) U7.12(GND_5) U7.13(GND_6) U7.14(GND_7) U7.15(GND_8) U7.16(GND) U28.6(VSS_2) U28.15(AN9/C3INA/RPB15/SCK2/CTED6/PMCS1/RB15) U28.16(AVSS) U28.19(PGED3/VREF+/CVREF+/AN0/C3INC/RPA0/CTED1/PMD7/RA0) U28.23(AN4/C1INB/C2IND/RPB2/SDA2/CTED13/PMD2/RB2) U28.24(AN5/C1INA/C2INC/RTCC/RPB3/SCL2/PMWR/RB3) U28.27(AN8/RPC2/PMA2/RC2) U28.29(VSS_3) U28.32(TDO/RPA8/PMA8/RA8) U28.35(TDI/RPA9/PMA9/RA9) U28.39(VSS) U28.44(RPB8/SCL1/CTED10/PMD4/RB8)
DRDY: U8.47(!DRDY) U28.43(RPB7/CTED3/PMD5/INT0/RB7)
DVDD: C3.1 C6.1 C7.1 C8.1 C18.2 C21.1 C28.1 C29.1 C146.1 C147.1 C150.1 C159.1 C160.1 C161.1 C162.1 C187.1 C188.1 C189.1 C190.1 C215.1 C216.1 C217.1 C218.1 C243.1 C244.1 C245.1 C246.1 C271.1 C272.1 C273.1 C274.1 C299.1 C300.1 J3.P4(VDD) JP7.2 JP8.1 PIC-BOOT.3(P) PIC-BOOT.4(P1) R61.1 U3.1(IN) U3.3(EN) U5.4(!SD) U5.5(V+) U6.5(VOUT) U7.7(VDDIO) U7.8(VDD) U8.35(!PWDN) U8.48(DVDD_2) U8.50(DVDD) U9.35(!PWDN) U9.48(DVDD_2) U9.50(DVDD) U10.35(!PWDN) U10.48(DVDD_2) U10.50(DVDD) U11.35(!PWDN) U11.48(DVDD_2) U11.50(DVDD) U12.35(!PWDN) U12.48(DVDD_2) U12.50(DVDD) U13.35(!PWDN) U13.48(DVDD_2) U13.50(DVDD) U28.10(VUSB3V3) U28.17(AVDD) U28.28(VDD_2) U28.40(VDD) U28.42(VBUS)
ESP_SS: R6.2 U1.10(IO15) U28.1(RPB9/SDA1/CTED4/PMD3/RB9)
GPIO1: JP19.1 U28.4(RPC8/PMA5/RC8)
GPIO2: JP19.2 U28.5(RPC9/CTED7/PMA6/RC9)
GPIO3: JP19.3 U28.8(PGED2/RPB10/D+/CTED11/RB10)
GPIO4: JP19.4 U28.9(PGEC2/RPB11/D-/RB11)
IN1N: C123.1 R57.2 U8.15(IN1N)
IN1P: C122.1 R58.2 U8.16(IN1P)
IN2N: C117.1 R55.2 U8.13(IN2N)
IN2P: C116.1 R56.2 U8.14(IN2P)
IN3N: C119.1 R53.2 U8.11(IN3N)
IN3P: C118.1 R54.2 U8.12(IN3P)
IN4N: C113.1 R51.2 U8.9(IN4N)
IN4P: C112.1 R52.2 U8.10(IN4P)
IN5N: C115.1 R49.2 U9.15(IN1N)
IN5P: C114.1 R50.2 U9.16(IN1P)
IN6N: C109.1 R47.2 U9.13(IN2N)
IN6P: C108.1 R48.2 U9.14(IN2P)
IN7N: C111.1 R45.2 U9.11(IN3N)
IN7P: C110.1 R46.2 U9.12(IN3P)
IN8N: C105.1 R43.2 U9.9(IN4N)
IN8P: C104.1 R44.2 U9.10(IN4P)
IN9N: C107.1 R41.2 U10.15(IN1N)
IN9P: C106.1 R42.2 U10.16(IN1P)
IN10N: C101.1 R39.2 U10.13(IN2N)
IN10P: C100.1 R40.2 U10.14(IN2P)
IN11N: C103.1 R37.2 U10.11(IN3N)
IN11P: C102.1 R38.2 U10.12(IN3P)
IN12N: C97.1 R35.2 U10.9(IN4N)
IN12P: C96.1 R36.2 U10.10(IN4P)
IN13N: C99.1 R33.2 U11.15(IN1N)
IN13P: C98.1 R34.2 U11.16(IN1P)
IN14N: C93.1 R31.2 U11.13(IN2N)
IN14P: C92.1 R32.2 U11.14(IN2P)
IN15N: C95.1 R29.2 U11.11(IN3N)
IN15P: C94.1 R30.2 U11.12(IN3P)
IN16N: C89.1 R27.2 U11.9(IN4N)
IN16P: C88.1 R28.2 U11.10(IN4P)
IN17N: C91.1 R25.2 U12.15(IN1N)
IN17P: C90.1 R26.2 U12.16(IN1P)
IN18N: C85.1 R23.2 U12.13(IN2N)
IN18P: C84.1 R24.2 U12.14(IN2P)
IN19N: C87.1 R21.2 U12.11(IN3N)
IN19P: C86.1 R22.2 U12.12(IN3P)
IN20N: C81.1 R19.2 U12.9(IN4N)
IN20P: C80.1 R20.2 U12.10(IN4P)
IN21N: C83.1 R17.2 U13.15(IN1N)
IN21P: C82.1 R18.2 U13.16(IN1P)
IN22N: C77.1 R15.2 U13.13(IN2N)
IN22P: C76.1 R16.2 U13.14(IN2P)
IN23N: C79.1 R13.2 U13.11(IN3N)
IN23P: C78.1 R14.2 U13.12(IN3P)
IN24N: C73.1 R11.2 U13.9(IN4N)
IN24P: C72.1 R12.2 U13.10(IN4P)
INT1: U7.6(INT1) U28.21(PGED1/AN2/C1IND/C2INB/C3IND/RPB0/PMD0/RB0)
MCLK: JP8.6 U8.37(CLK) U9.37(CLK) U10.37(CLK) U11.37(CLK) U12.37(CLK) U13.37(CLK)
MCLR: JP7.1 R66.1 U28.18(!MCLR)
MISO_1: JP8.3 JP12.1 U8.43(DOUT) U28.41(RPB5/USBID/RB5)
MISO_2: J3.P7(DATA0) JP12.3 U1.6(IO12) U7.3(SDO) U28.34(SOSCO/RPA4/T1CK/CTED9/RA4)
MOSI_1: JP8.7 JP12.2 U8.34(DIN) U9.34(DIN) U10.34(DIN) U11.34(DIN) U12.34(DIN) U13.34(DIN) U28.20(PGEC3/VREF-/CVREF-/AN1/RPA1/CTED2/PMD6/RA1)
MOSI_2: J3.P3(CMD) JP12.4 U1.7(IO13) U7.2(SDI) U28.22(PGEC1/AN3/C1INC/C2INA/RPB1/CTED12/PMD1/RB1)
N$1: R2.1 U1.3(EN)
N$2: ESP-RST.1(S) ESP-RST.2(S1) R1.1 U1.1(RST)
N$3: D1.A U1.14(IO5)
N$4: D1.C R5.1
N$5: ESP-BOOT.3(P) ESP-BOOT.4(P1) R3.1 U1.12(IO0)
N$6: D2.C R3.2
N$7: R4.1 U1.11(IO2)
N$10: C1.1 U2.4(FB)
N$13: R7.2 U4.3(EN)
N$15: C20.1 CR2.1 R7.1 U4.1(VIN)
N$16: C10.1 U5.6(CAP+)
N$17: C10.2 U5.3(CAP-)
N$18: R8.2 U6.3(EN)
N$22: D3.A R67.1
N$23: C151.2 MCLR/RESET.1(S) MCLR/RESET.2(S1) R61.2 R66.2
N$28: C12.1 C13.1 U8.24(VREFP)
N$29: C14.1 U8.28(VCAP1)
N$30: C15.1 U8.30(VCAP2)
N$31: C16.1 U8.26(VCAP4)
N$32: C17.1 C24.1 U8.55(VCAP3)
N$33: C25.1 U8.64(WCT)
N$34: C32.1 C33.1 U9.24(VREFP)
N$35: C34.1 U9.28(VCAP1)
N$36: C35.1 U9.30(VCAP2)
N$37: C36.1 U9.26(VCAP4)
N$38: C37.1 C38.1 U9.55(VCAP3)
N$39: C39.1 U9.64(WCT)
N$40: C40.1 C41.1 U10.24(VREFP)
N$41: C42.1 U10.28(VCAP1)
N$42: C43.1 U10.30(VCAP2)
N$43: C44.1 U10.26(VCAP4)
N$44: C45.1 C46.1 U10.55(VCAP3)
N$45: C47.1 U10.64(WCT)
N$51: C48.1 C49.1 U11.24(VREFP)
N$52: C50.1 U11.28(VCAP1)
N$53: C51.1 U11.30(VCAP2)
N$54: C52.1 U11.26(VCAP4)
N$55: C53.1 C54.1 U11.55(VCAP3)
N$56: C55.1 U11.64(WCT)
N$57: C124.2 U28.7(VCAP)
N$59: C125.1 R65.2 U28.31(OSC2/CLKO/RPA3/RA3) XTAL1.2
N$60: C126.1 R65.1 U28.30(OSC1/CLKI/RPA2/RA2) XTAL1.1
N$61: C127.1 R62.2 U13.63(RLDOUT)
N$65: C56.1 C57.1 U12.24(VREFP)
N$66: C58.1 U12.28(VCAP1)
N$67: C59.1 U12.30(VCAP2)
N$68: C60.1 U12.26(VCAP4)
N$69: C61.1 C62.1 U12.55(VCAP3)
N$70: C63.1 U12.64(WCT)
N$73: D3.C R63.2
N$79: C64.1 C65.1 U13.24(VREFP)
N$80: C66.1 U13.28(VCAP1)
N$81: C67.1 U13.30(VCAP2)
N$82: C68.1 U13.26(VCAP4)
N$83: C69.1 C70.1 U13.55(VCAP3)
N$84: C71.1 U13.64(WCT)
N$85: U12.41(DAISY_IN) U13.43(DOUT)
N$86: U11.41(DAISY_IN) U12.43(DOUT)
N$88: U9.41(DAISY_IN) U10.43(DOUT)
N$89: U8.41(DAISY_IN) U9.43(DOUT)
PGC: JP7.5 U28.13(PGEC/TCK/CTED8/PMA7/RA7)
PGD: JP7.4 R67.2 U28.12(PGED/TMS/PMA10/RA10)
RAW: C9.1 CR1.1 R8.1 U6.1(VIN)
RESET: JP8.5 JP12.6 U8.36(!RESET) U9.36(!RESET) U10.36(!RESET) U11.36(!RESET) U12.36(!RESET) U13.36(!RESET) U28.26(AN7/RPC1/RC1)
RLD1: JP20.10 R59.1 U26.2(IO2)
RLD2: JP21.10 R71.1 U30.5(IO4)
RLD3: JP1.10 R70.1 U30.2(IO2)
RLD4: JP22.10 R69.1 U30.1(IO1)
RLD5: JP2.10 R68.1 U27.4(IO3)
RLD6: JP3.10 R72.1 U27.5(IO4)
RLDIN1: C121.1 R59.2 U8.62(RLDIN)
RLDIN2: C152.1 R71.2 U9.62(RLDIN)
RLDIN3: C153.1 R70.2 U10.62(RLDIN)
RLDIN4: C154.1 R69.2 U11.62(RLDIN)
RLDIN5: C155.1 R68.2 U12.62(RLDIN)
RLDIN6: C156.1 R72.2 U13.62(RLDIN)
RLDINV: C127.2 JP11.2 R62.1 U8.61(RLDINV) U9.61(RLDINV) U10.61(RLDINV) U11.61(RLDINV) U12.61(RLDINV) U13.61(RLDINV)
RXD: JP9.3 U1.15(RXD0)
SCLK: J3.P5(CLK) JP8.4 JP12.5 U1.5(IO14) U7.1(SPC) U8.40(SCLK) U9.40(SCLK) U10.40(SCLK) U11.40(SCLK) U12.40(SCLK) U13.40(SCLK) U28.14(CVREFOUT/AN10/C3INB/RPB14/VBUSON/SCK1/CTED5/RB14)
SRB1: JP20.9
SRB2: JP21.9
SRB3: JP1.9
SRB4: JP22.9
SRB5: JP2.9
SRB6: JP3.9
START: U8.38(START) U9.38(START) U10.38(START) U11.38(START) U12.38(START) U13.38(START) U28.36(AN12/RPC3/RC3)
TXD: JP9.4 U1.16(TXDO)
U1RX: JP10.1 U28.11(AN11/RPB13/CTPLS/PMRD/RB13)
U1TX: JP10.2 U28.3(RPC7/PMA0/RC7)
Unconnected: J3.CD(DETECT) J3.P1(DATA2) J3.P8(DATA1) J3.S1(SHIELD) J3.S2(SHIELD) J3.S3(SHIELD) J3.S4(SHIELD) JP7.6 JP7.7 JP7.8 U1.2(ADC) U1.4(IO16) U1.13(IO4) U3.4(NC) U4.4(NC) U6.4(NC) U7.5(INT2) U8.27(NC_2) U8.29(NC) U8.63(RLDOUT) U9.27(NC_2) U9.29(NC) U9.47(!DRDY) U9.63(RLDOUT) U10.27(NC_2) U10.29(NC) U10.47(!DRDY) U10.63(RLDOUT) U11.27(NC_2) U11.29(NC) U11.47(!DRDY) U11.63(RLDOUT) U12.27(NC_2) U12.29(NC) U12.47(!DRDY) U12.63(RLDOUT) U13.27(NC_2) U13.29(NC) U13.47(!DRDY) U14.1(IO1) U14.6(NC) U15.6(NC) U16.6(NC) U17.6(NC) U18.6(NC) U19.6(NC) U20.6(NC) U21.6(NC) U22.6(NC) U23.6(NC) U24.6(NC) U25.6(NC) U26.5(IO4) U26.6(NC) U27.6(NC) U30.4(IO3) U30.6(NC)

## Notes on the sheet
- PIC32 Microcontroller
- Power Components | Pin Headers
- Battery Connectors | Voltage Inverter | +2.5V Regulator
- uC GPIO
- Wi-Fi Programming Pins
- UART | PICkit4
- Daisy
- SPI Test
- Electrode Inputs
- GND Test
- 3.3V Regulator (Wi-Fi) | 3.3V Regulator | -2.5V Regulator
- Wi-Fi Module
- Ferrite Beads
- Peripherals
- Accelerometer | SD Card
- ESD Protection
- Daisy-Chain ADCs (Part 1)
- ADS 1194
- Daisy-Chain ADCs (Part 2)
- ESD Protection
- ADS 1194

## Library data of the parts
C1-C17 C19-C74 C76-C119 C121-C131 C134-C147 C150-C156 C159-C170 C173-C184 C187-C198 C201-C212 C215-C226 C229-C240 C243-C254 C257-C268 C271-C282 C285-C296 C299 C300 = Capacitor:C: Capacitor - Generic; CATEGORY: Capacitor
C18 = Alumnium_Cap:MCVVT035M470EA1L; COPYRIGHT: Copyright (C) 2023 Ultra Librarian. All rights reserved.; MANUFACTURER_PART_NUMBER: MCVVT035M470EA1L; MFR_NAME: Multicomp
CR1 CR2 = Schottky_BAT85:BAT85,113; COPYRIGHT: Copyright (C) 2023 Ultra Librarian. All rights reserved.; MANUFACTURER_PART_NUMBER: BAT85,113; MFR_NAME: Nexperia
D1-D3 = LED:CHIP-FLAT-B; CATEGORY: LED; COLOR: BLUE; DESCRIPTION: CHIP LED FLAT; SUB-CATEGORY: CHIP; TYPE: FLAT_TOP
ESP-BOOT ESP-RST MCLR/RESET PIC-BOOT = switch-omron:10-XX: OMRON SWITCH; MPN: B3F-1000; OC_FARNELL: 176432; OC_NEWARK: 36M3542
FB1-FB3 FB5 FB6 FB9 = Filter:FB: Ferrite Bead - Generic; CATEGORY: Filter; SUB-CATEGORY: Ferrite bead
J3 = MEM2051-00-195-00-A_REVD1:MEM2051-00-195-00-A_REVD1; MANUFACTURER: GCT; MAXIMUM_PACKAGE_HEIGHT: 2.05 mm; PARTREV: D1; SNAPEDA_PN: MEM2051-00-195-00-A; STANDARD: Manufacturer Recommendations
JP1-JP3 JP20-JP22 = Connector:PINHD-2X5: PIN HEADER; CATEGORY: CONNECTOR; SUB-CATEGORY: PIN-HEADER
JP4 JP11 JP23 = Connector:PINHD-1X2: PIN HEADER; CATEGORY: CONNECTOR; SUB-CATEGORY: PIN-HEADER
JP5 JP6 = Connector:PINHD-2X2: PIN HEADER; CATEGORY: CONNECTOR; SUB-CATEGORY: PIN-HEADER
JP7 = Connector:PINHD-1X10: PIN HEADER; CATEGORY: CONNECTOR; SUB-CATEGORY: PIN-HEADER
JP8 = Connector:PINHD-1X8: PIN HEADER; CATEGORY: CONNECTOR; SUB-CATEGORY: PIN-HEADER
JP9 JP19 = Connector:PINHD-1X4: PIN HEADER; CATEGORY: CONNECTOR; SUB-CATEGORY: PIN-HEADER
JP10 = Connector:PINHD-1X3: PIN HEADER; CATEGORY: CONNECTOR; SUB-CATEGORY: PIN-HEADER
JP12 = Connector:PINHD-1X7: PIN HEADER; CATEGORY: CONNECTOR; SUB-CATEGORY: PIN-HEADER
JP13-JP18 = Connector:PINHD-1X1: PIN HEADER; CATEGORY: CONNECTOR; SUB-CATEGORY: PIN-HEADER
R1-R8 R10-R59 R61-R72 = Resistor:R: Resistor Fixed - Generic; CATEGORY: Resistor; SUB-CATEGORY: Fixed
U1 = ESP07:ESP-07S; COPYRIGHT: Copyright (C) 2023 Ultra Librarian. All rights reserved.; MANUFACTURER_PART_NUMBER: ESP-07S; MFR_NAME: RF Solutions
U2 = TPS72325DBVT:TPS72325DBVT; COPYRIGHT: Copyright (C) 2023 Ultra Librarian. All rights reserved.; MANUFACTURER_PART_NUMBER: TPS72325DBVT; MFR_NAME: Texas Instruments; REFDES: RefDes; TYPE: TYPE
U3 = TLV70012QDDCRQ1:TLV70012QDDCRQ1; COPYRIGHT: Copyright (C) 2023 Ultra Librarian. All rights reserved.; MANUFACTURER_PART_NUMBER: TLV70012QDDCRQ1; MFR_NAME: Texas Instruments
U4 U6 = AP2112K-3.3TRG1:AP2112K-3.3TRG1; COPYRIGHT: Copyright (C) 2023 Ultra Librarian. All rights reserved.; MANUFACTURER_PART_NUMBER: AP2112K-3.3TRG1; MFR_NAME: Diodes Inc
U5 = LM2664M6:LM2664M6
U7 = LIS3DHHTR :LIS3DHHTR; COPYRIGHT: Copyright (C) 2023 Ultra Librarian. All rights reserved.; MANUFACTURER_PART_NUMBER: LIS3DHHTR; MFR_NAME: STMicroelectronics
U8-U13 = ADS1194CPAG:ADS1194CPAG; COPYRIGHT: Copyright (C) 2023 Ultra Librarian. All rights reserved.; MANUFACTURER_PART_NUMBER: ADS1194CPAG; MFR_NAME: Texas Instruments
U14-U27 U30 = TPD4E1B06DCKR:TPD4E1B06DCKR; COPYRIGHT: Copyright (C) 2023 Ultra Librarian. All rights reserved.; MANUFACTURER_PART_NUMBER: TPD4E1B06DCKR; MFR_NAME: Texas Instruments
U28 = PIC32MX250F128D-50I/PT:PIC32MX250F128D-50I/PT; COPYRIGHT: Copyright (C) 2023 Ultra Librarian. All rights reserved.; MANUFACTURER_PART_NUMBER: PIC32MX250F128D-50I/PT; MFR_NAME: Microchip
XTAL1 = Frequency-Source:CRYSTAL: Crystal 2Pin - Generic; CATEGORY: Frequency-Source; SUB-CATEGORY: Crystal-2Pin; VALUE: HC49